# Altium project CANLink.PrjPcb (part 1 of 2)
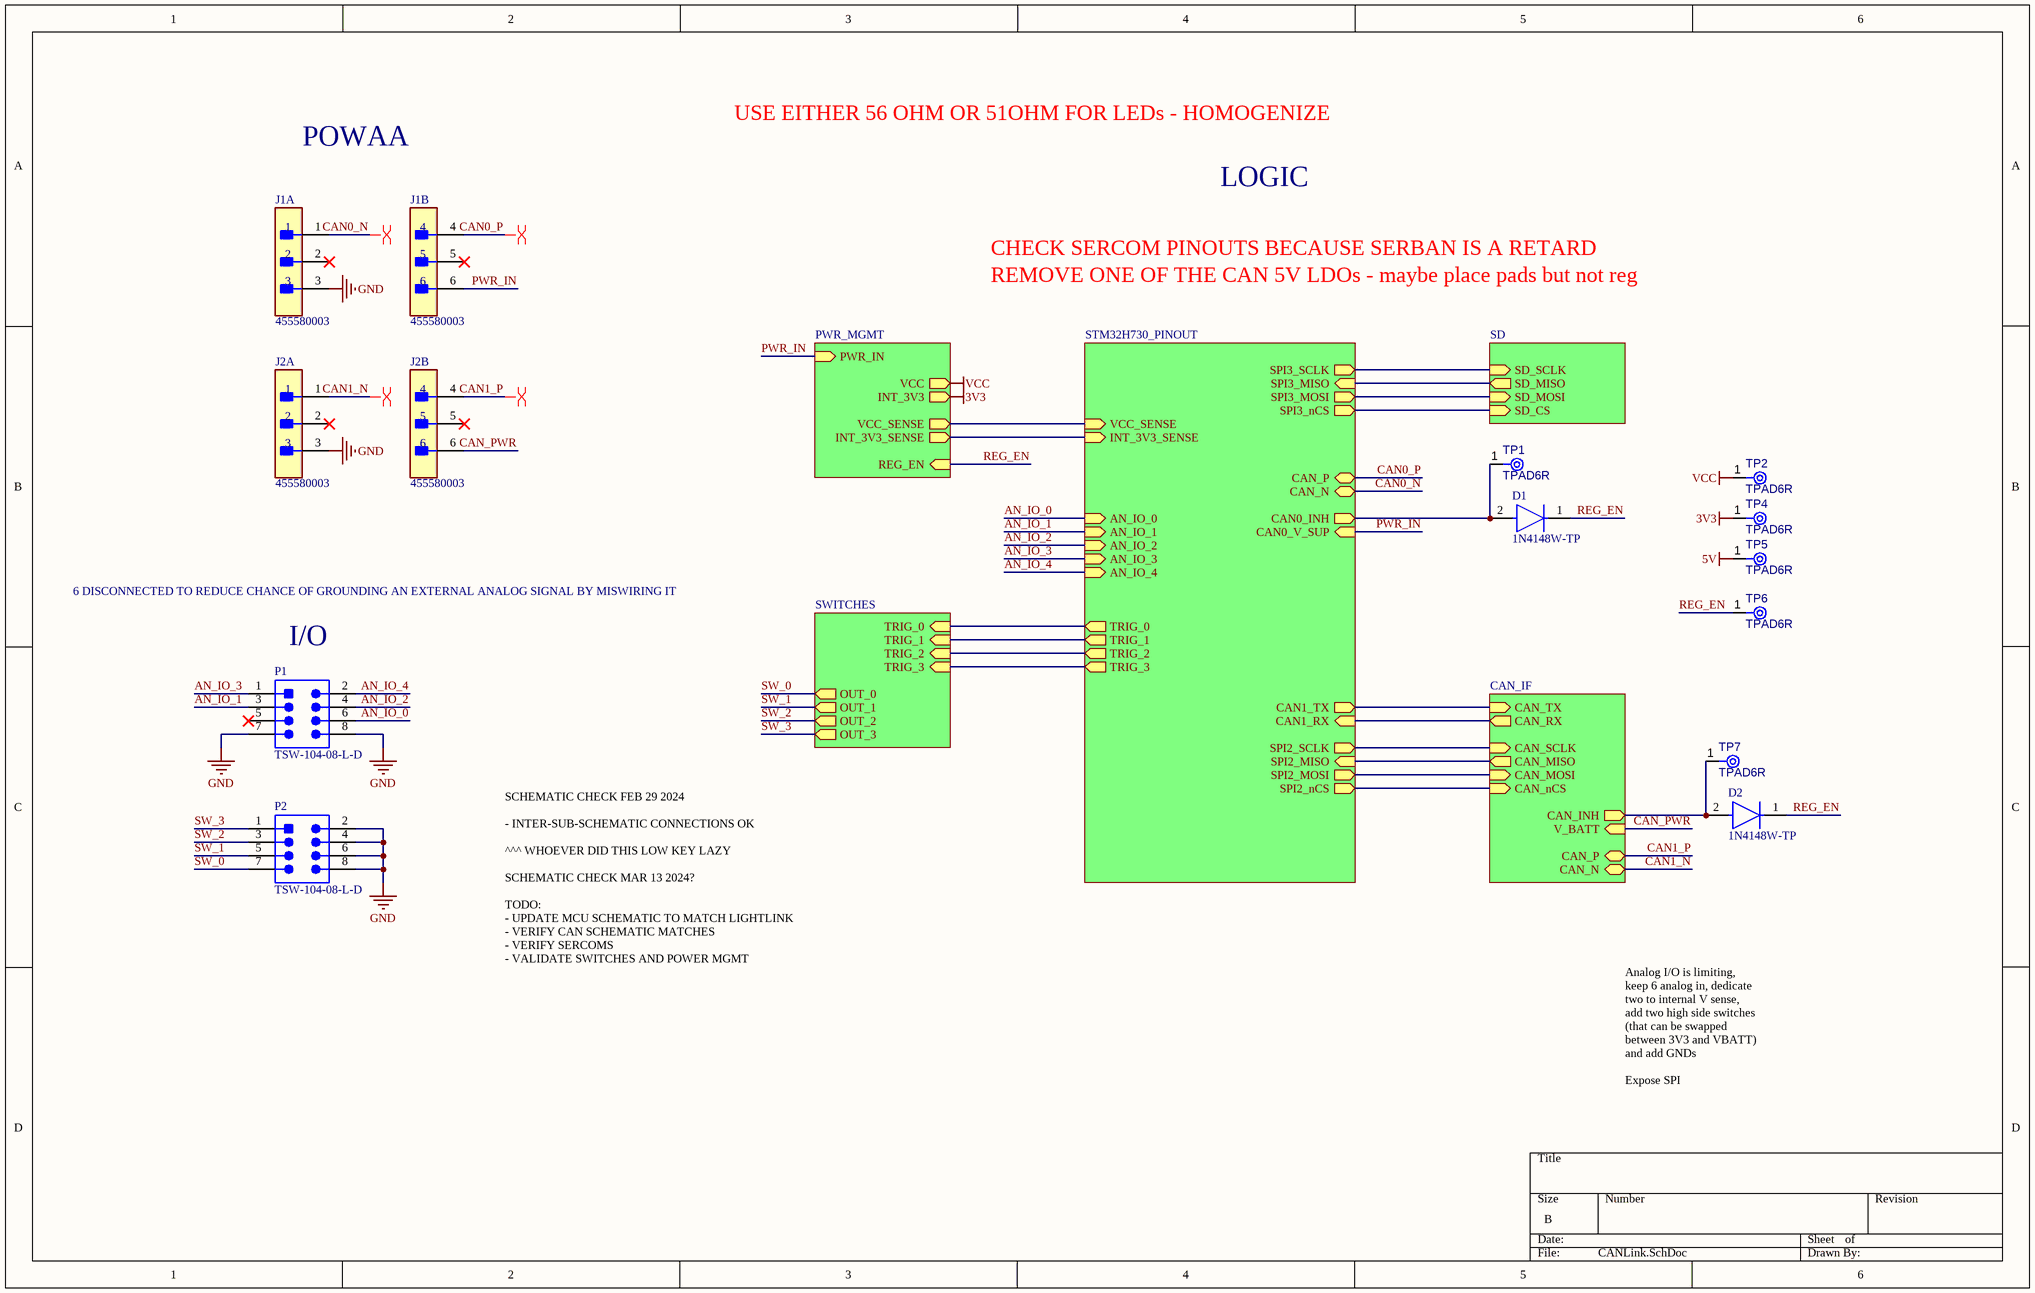
[diagram p0: CANLink.SchDoc]
6 sheets, 171 parts. Net scope: hierarchical (ports join the sheet entries above them; power ports are global).
Board file: CANLink.PcbDoc
Sheets:
  CANLink.SchDoc
    MCU_0 = STM32H730_PINOUT.SchDoc
    SD_0 = SD.SchDoc
    CAN_1 = CAN_IF.SchDoc
    PWR_MGMT = PWR_MGMT.SchDoc
    SWITCHES = SWITCHES.SchDoc

## Sheet CANLink.SchDoc
size B; SheetNumber: 1; SheetTotal: 6

### Parts
(Parts that share a designator on the sheet are numbered #1, #2 ... from top to bottom, then left to right.)
D1#1  1N4148W-TP  [FP-SOD-123-IPC_A]
D2  1N4148W-TP  [FP-SOD-123-IPC_A]
J1  455580003  [FP-455580003-MFG]  (parts A,B of 2)
J2  455580003  [FP-455580003-MFG]  (parts A,B of 2)
P1  TSW-104-08-L-D  [SMTC-TSW-104-08-L-D_V]
P2  TSW-104-08-L-D  [SMTC-TSW-104-08-L-D_V]
TP1  TPAD6R  [TP06R]  (no BOM)
TP2  TPAD6R  [TP06R]  (no BOM)
TP4  TPAD6R  [TP06R]  (no BOM)
TP5  TPAD6R  [TP06R]  (no BOM)
TP6  TPAD6R  [TP06R]  (no BOM)
TP7  TPAD6R  [TP06R]  (no BOM)

### Sub-sheets
CAN_1 = CAN_IF: CAN_TX (in), CAN_RX (out), CAN_SCLK (in), CAN_MISO (out), CAN_MOSI (in), CAN_nCS (in), CAN_INH (out), V_BATT (in), CAN_P (bidir), CAN_N (bidir)
MCU_0 = STM32H730_PINOUT: SPI2_MOSI (out), SPI2_MISO (in), SPI2_SCLK (out), SPI2_nCS (out), CAN1_TX (out), CAN1_RX (in), SPI3_MOSI (out), SPI3_MISO (in), SPI3_nCS (out), VCC_SENSE (in), INT_3V3_SENSE (in), AN_IO_1 (in), AN_IO_0 (in), AN_IO_2 (in), AN_IO_3 (in), AN_IO_4 (in), TRIG_0 (out), TRIG_1 (out), TRIG_2 (out), TRIG_3 (out), CAN0_INH (out), CAN_P (bidir), CAN_N (bidir), CAN0_V_SUP (in), SPI3_SCLK (out)
PWR_MGMT = PWR_MGMT: PWR_IN (in), VCC (out), INT_3V3 (out), VCC_SENSE (out), INT_3V3_SENSE (out), REG_EN (in)
SD_0 = SD: SD_MOSI (in), SD_CS (in), SD_MISO (out), SD_SCLK (in)
SWITCHES = SWITCHES: TRIG_0 (in), TRIG_1 (in), TRIG_2 (in), TRIG_3 (in), OUT_0 (out), OUT_1 (out), OUT_2 (out), OUT_3 (out)

### Nets
3V3: TP4.1(TP) ; sheet PWR_MGMT/INT_3V3  [project net INT_3V3]
5V: TP5.1(TP)
GND: J1.3 J2.3 P1.7 P1.8 P2.2 P2.4 P2.6 P2.8
VCC: TP2.1(TP) ; sheet PWR_MGMT/VCC  [project net PRE_VCC]
AN_IO_0: P1.6 ; sheet MCU_0/AN_IO_0
AN_IO_1: P1.3 ; sheet MCU_0/AN_IO_1
AN_IO_2: P1.4 ; sheet MCU_0/AN_IO_2
AN_IO_3: P1.1 ; sheet MCU_0/AN_IO_3
AN_IO_4: P1.2 ; sheet MCU_0/AN_IO_4
CAN0_INH: D1#1.2(A) TP1.1(TP) ; sheet MCU_0/CAN0_INH
CAN0_N: J1.1 ; sheet MCU_0/CAN_N
CAN0_P: J1.4 ; sheet MCU_0/CAN_P
CAN1_N: J2.1 ; sheet CAN_1/CAN_N
CAN1_P: J2.4 ; sheet CAN_1/CAN_P
CAN1_RX: sheet MCU_0/CAN1_RX, sheet CAN_1/CAN_RX
CAN1_TX: sheet MCU_0/CAN1_TX, sheet CAN_1/CAN_TX
CAN_INH: D2.2(A) TP7.1(TP) ; sheet CAN_1/CAN_INH
CAN_MISO: sheet MCU_0/SPI2_MISO, sheet CAN_1/CAN_MISO
CAN_MOSI: sheet MCU_0/SPI2_MOSI, sheet CAN_1/CAN_MOSI
CAN_nCS: sheet MCU_0/SPI2_nCS, sheet CAN_1/CAN_nCS
CAN_PWR: J2.6 ; sheet CAN_1/V_BATT
CAN_SCLK: sheet MCU_0/SPI2_SCLK, sheet CAN_1/CAN_SCLK
INT_3V3_SENSE: sheet MCU_0/INT_3V3_SENSE, sheet PWR_MGMT/INT_3V3_SENSE
PWR_IN: J1.6 ; sheet MCU_0/CAN0_V_SUP, sheet PWR_MGMT/PWR_IN  [project net CAN0_V_SUP]
REG_EN: D1#1.1(C) D2.1(C) TP6.1(TP) ; sheet PWR_MGMT/REG_EN
SD_CLK: sheet MCU_0/SPI3_SCLK, sheet SD_0/SD_SCLK
SD_CMD: sheet MCU_0/SPI3_MOSI, sheet SD_0/SD_MOSI
SD_CS: sheet MCU_0/SPI3_nCS, sheet SD_0/SD_CS
SD_DAT0: sheet MCU_0/SPI3_MISO, sheet SD_0/SD_MISO
SW_0: P2.7 ; sheet SWITCHES/OUT_0  [project net OUT_0]
SW_1: P2.5 ; sheet SWITCHES/OUT_1  [project net OUT_1]
SW_2: P2.3 ; sheet SWITCHES/OUT_2  [project net OUT_2]
SW_3: P2.1 ; sheet SWITCHES/OUT_3  [project net OUT_3]
TRIG_0: sheet MCU_0/TRIG_0, sheet SWITCHES/TRIG_0
TRIG_1: sheet MCU_0/TRIG_1, sheet SWITCHES/TRIG_1
TRIG_2: sheet MCU_0/TRIG_2, sheet SWITCHES/TRIG_2
TRIG_3: sheet MCU_0/TRIG_3, sheet SWITCHES/TRIG_3
VCC_SENSE: sheet MCU_0/VCC_SENSE, sheet PWR_MGMT/VCC_SENSE

Not connected (* = marked no-connect by the designer): J1 2* 5*; J2 2* 5*; P1 5*

### Layout directives
differential pair: CAN0_N, CAN0_P, CAN1_N, CAN1_P

### Notes on the sheet
- POWAA
- USE EITHER 56 OHM OR 51OHM FOR LEDs - HOMOGENIZE
- LOGIC
- CHECK SERCOM PINOUTS BECAUSE SERBAN IS A RETARD
- REMOVE ONE OF THE CAN 5V LDOs - maybe place pads but not reg
- 6 DISCONNECTED TO REDUCE CHANCE OF GROUNDING AN EXTERNAL ANALOG SIGNAL BY MISWIRING IT
- (near P1) I/O
- Analog I/O is limiting, keep 6 analog in, dedicate two to internal V sense, add two high side switches (that can be swapped between 3V3 and VBATT) and add GNDs
  Expose SPI
- SCHEMATIC CHECK FEB 29 2024
  - INTER-SUB-SCHEMATIC CONNECTIONS OK
  ^^^ WHOEVER DID THIS LOW KEY LAZY
  SCHEMATIC CHECK MAR 13 2024?
  TODO:
  - UPDATE MCU SCHEMATIC TO MATCH LIGHTLINK
  - VERIFY CAN SCHEMATIC MATCHES
  - VERIFY SERCOMS
  - VALIDATE SWITCHES AND POWER MGMT

### Library data of the parts
D1#1 D2 = CMP-2000-04993-2: DIODE GEN PURP 100V 150MA SOD123; Max Reverse Leakage Current: 5uA; Max Surge Current: 2A; Reverse Recovery Time: 4ns; Polarity: Standard; Capacitance: 4pF; Max Forward Surge Current (Ifsm): 1A; Element Configuration: Single; Power Dissipation: 400mW; Forward Voltage: 1V; Radiation Hardening: No; Lead Free: Lead Free; Max Reverse Voltage (DC): 100V; Current Rating: 150mA; Forward Current: 150mA; Packaging: Tape and Reel; Number of Pins: 2; Package Quantity: 3000; Max Operating Temperature: 150°C; Min Operating Temperature: -65°C; Average Rectified Current: 150mA; Recovery Time: 4ns; Output Current: 150mA; Peak Non-Repetitive Surge Current: 2A; Width: 1.8mm; Voltage Rating (DC): 100V; Height: 1.2mm; Max Repetitive Reverse Voltage (Vrrm): 100V; Mount: Surface Mount; Length: 2.85mm
J1 J2 = CMP-04776-000024-1: CONN HEADER R/A 6POS 4.2MM; Manufacturer: Molex; Standoff Height: 0.4mm; Conn Orientation: Right Angle; Number Of Contacts: 6; Conn Gender: Male; Voltage Rating: 600V; Current Rating: 8A; Footprint Url: https://www.molex.com/pdm_docs/sd/455580003_sd.pdf; Number Of Rows: 2; Lead Free: Yes; Digikey Description: CONN HEADER R/A 6POS 4.2MM; ComponentLink2URL: https://www.molex.com/webdocs/datasheets/pdf/en-us/0455580003_PCB_HEADERS.pdf; Octopart: https://octopart.com/45558-0003-molex-7672845; Package: 0; Device Class L3: unset; ComponentLink2Description: Datasheet; Device Class L2: Headers and Wire Housings; Category: Conn; Contact Material: Tin,Nickel; Mouser Description: Conn Power HDR 6 POS 4.2mm Solder ST Thru-Hole 6 Terminal 1 Port Mini-Fit Jr™ Tray; Manufacturer Part Number: 455580003; Pitch: 4.2mm; Device Class L1: Connectors; Temperature Range Low: -40°C; Temperature: -40°C to +105°C; RoHS: TRUE; Temperature Range High: +105°C; Height: 10.38mm; Automotive: No
P1 P2 = CMP-1681-00006-4: Male Header, Pitch 2.54 mm, 2 x 4 Position, Height 8.38 mm, Tail Length 5.08 mm, -55 to 125 degC, RoHS, Bulk; Manufacturer: Samtec; Voltage Rating: 550 V; Current Rating: 7.6 A; Rows: 2; ComponentLink2URL: https://datasheet.ciiva.com/25616/0900766b81154476-25616879.pdf; Package Quantity: 1; PackageDescription: Male Header, Pitch 2.54 mm, 2 x 4 Position, Height 8.38 mm, Tail Length 5.08 mm; ComponentLink1Description: Manufacturer URL; Lead Pitch: 0.1 inch; REACH SVHC: No SVHC; Mounting Technology: Through Hole; PackageReference: TSW-104-08-L-D; Contact Plating: Gold; DatasheetVersion: 04/2012; Colour: Black; Contact Finish: Gold; ComponentLink3URL: http://suddendocs.samtec.com/prints/tsw-xxx-xx-x-x-xx-xxx-footprint.pdf; ComponentLink3Description: Package Specification; Mount: Through Hole; RoHSCompliant: true; Packaging: Bulk; ComponentLink2Description: Datasheet; Contact Material: Bronze; Pins: 8; ComponentLink1URL: http://www.samtec.com/
TP1 TP2 TP4-TP7 = CMP-00028-00002-2: 0.6mm round; Pins: 1

## Sheet STM32H730_PINOUT.SchDoc
size D; SheetNumber: 5; SheetTotal: 6
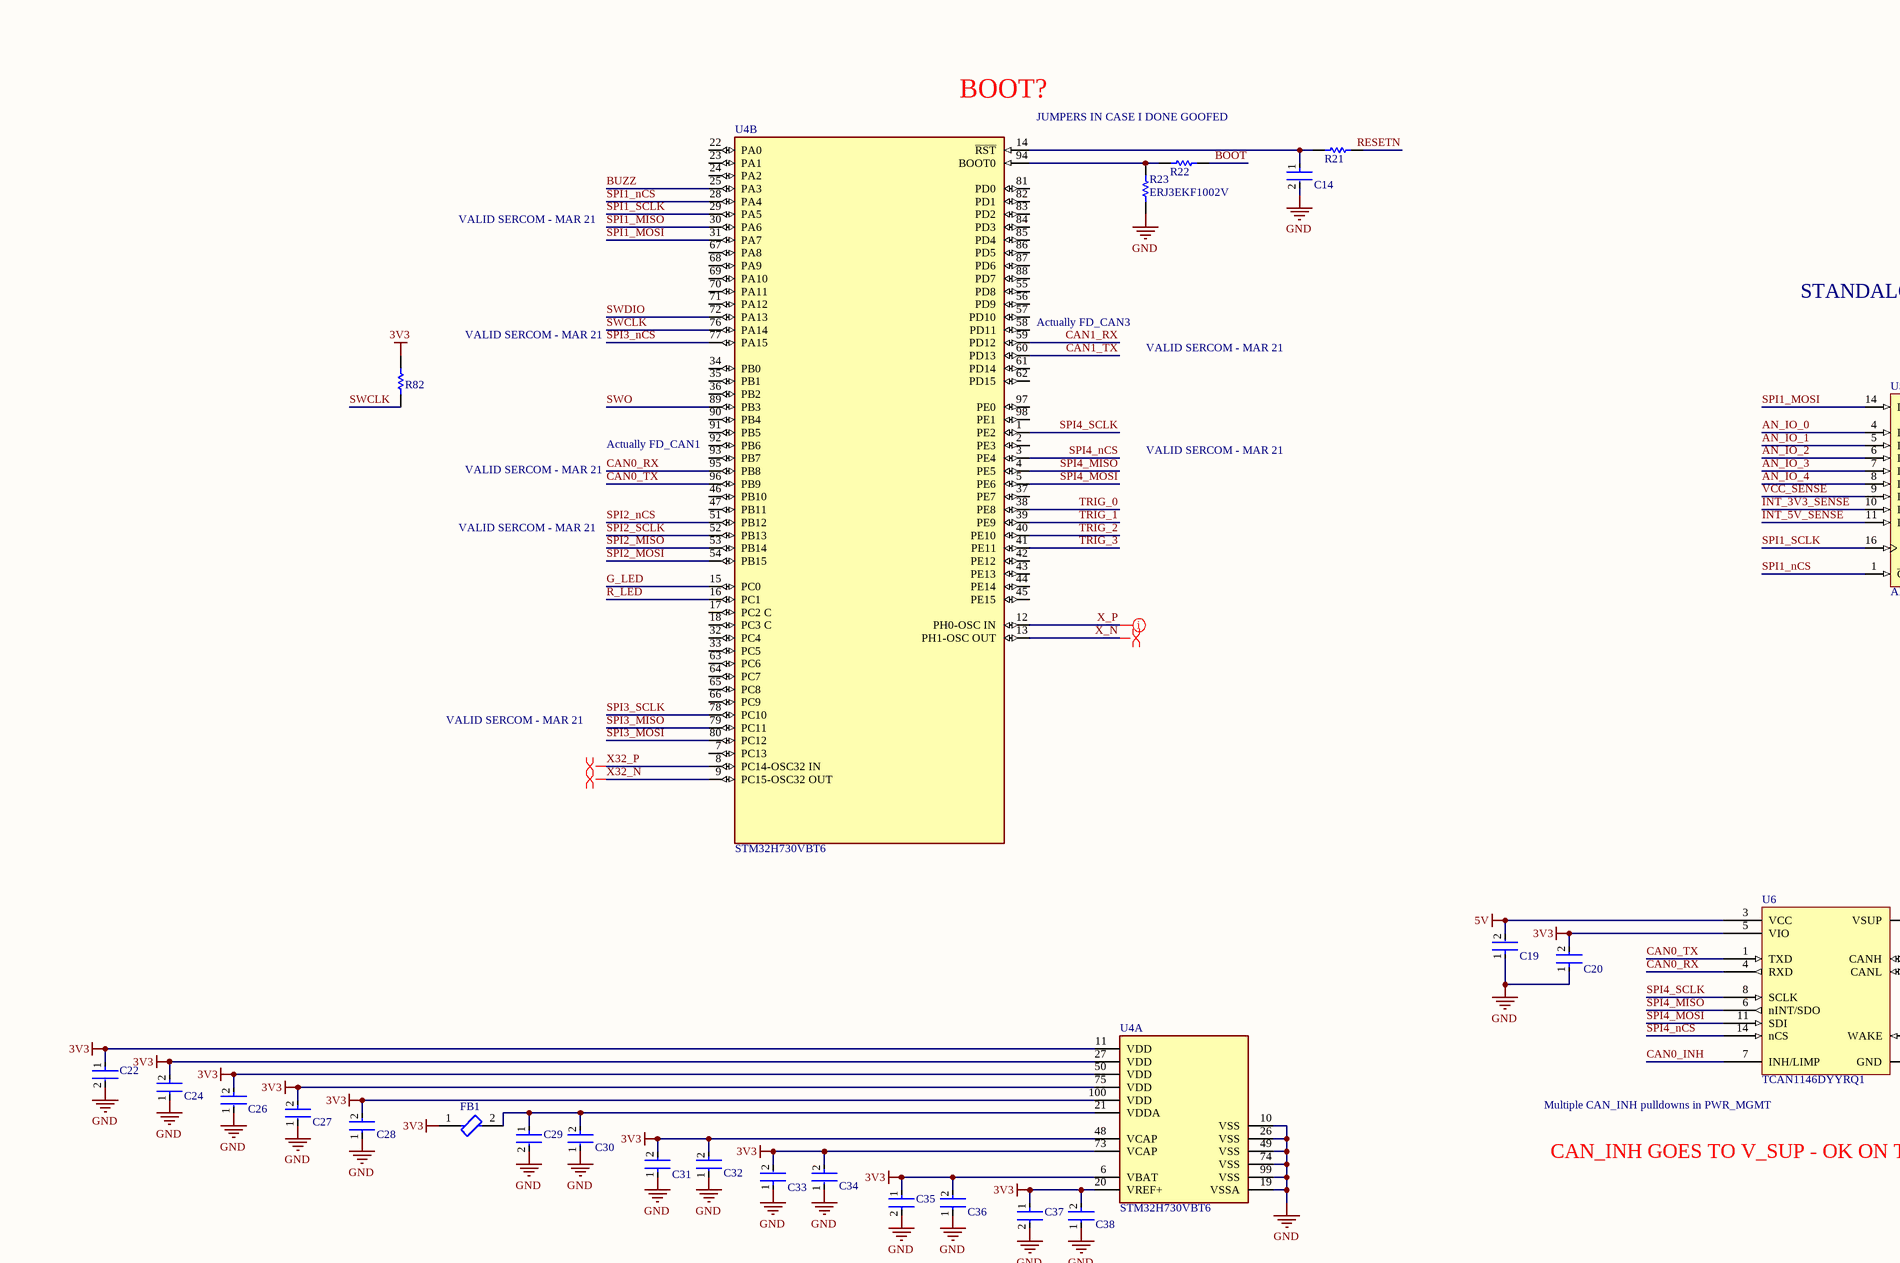
[diagram p1: STM32H730_PINOUT.SchDoc, top left]
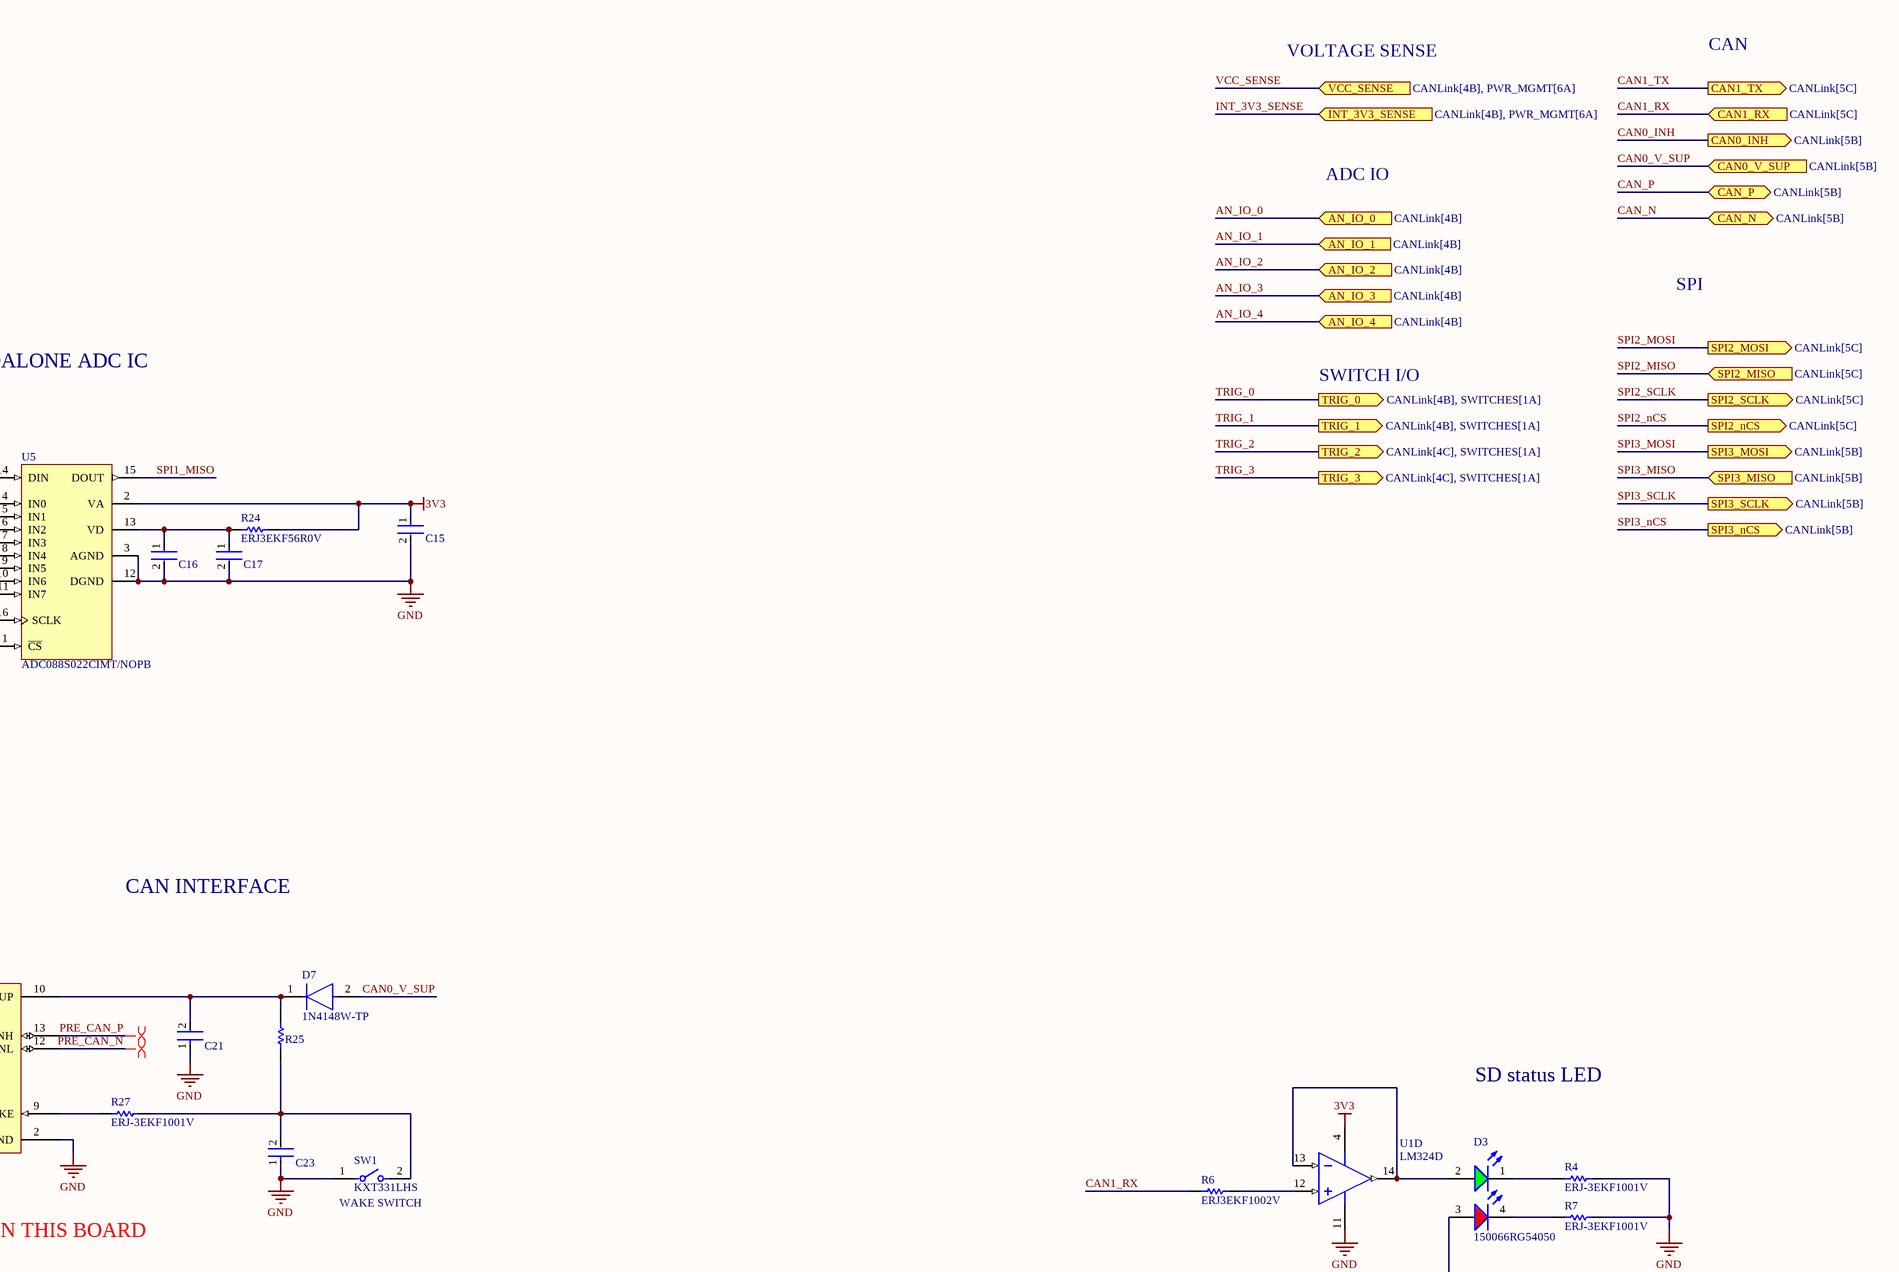
[diagram p2: STM32H730_PINOUT.SchDoc, top right]
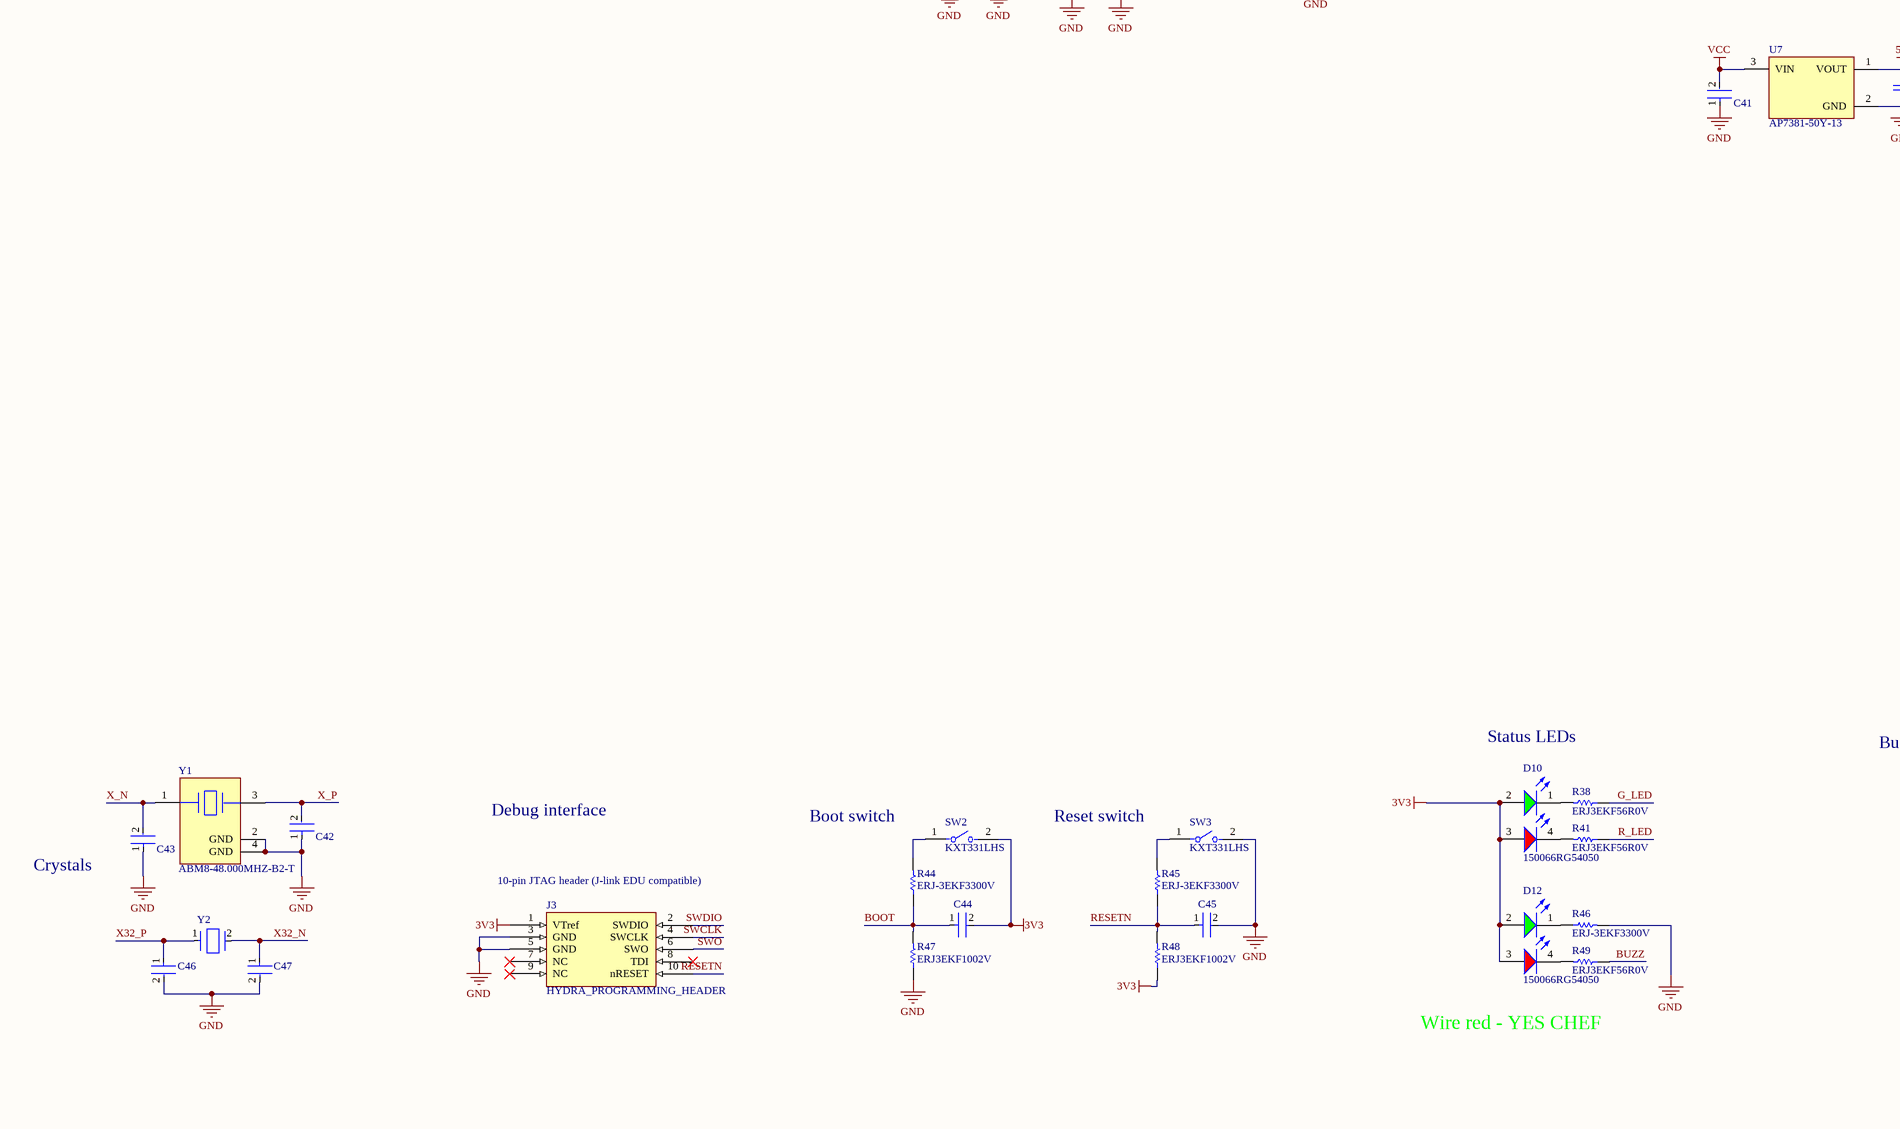
[diagram p3: STM32H730_PINOUT.SchDoc, bottom left]
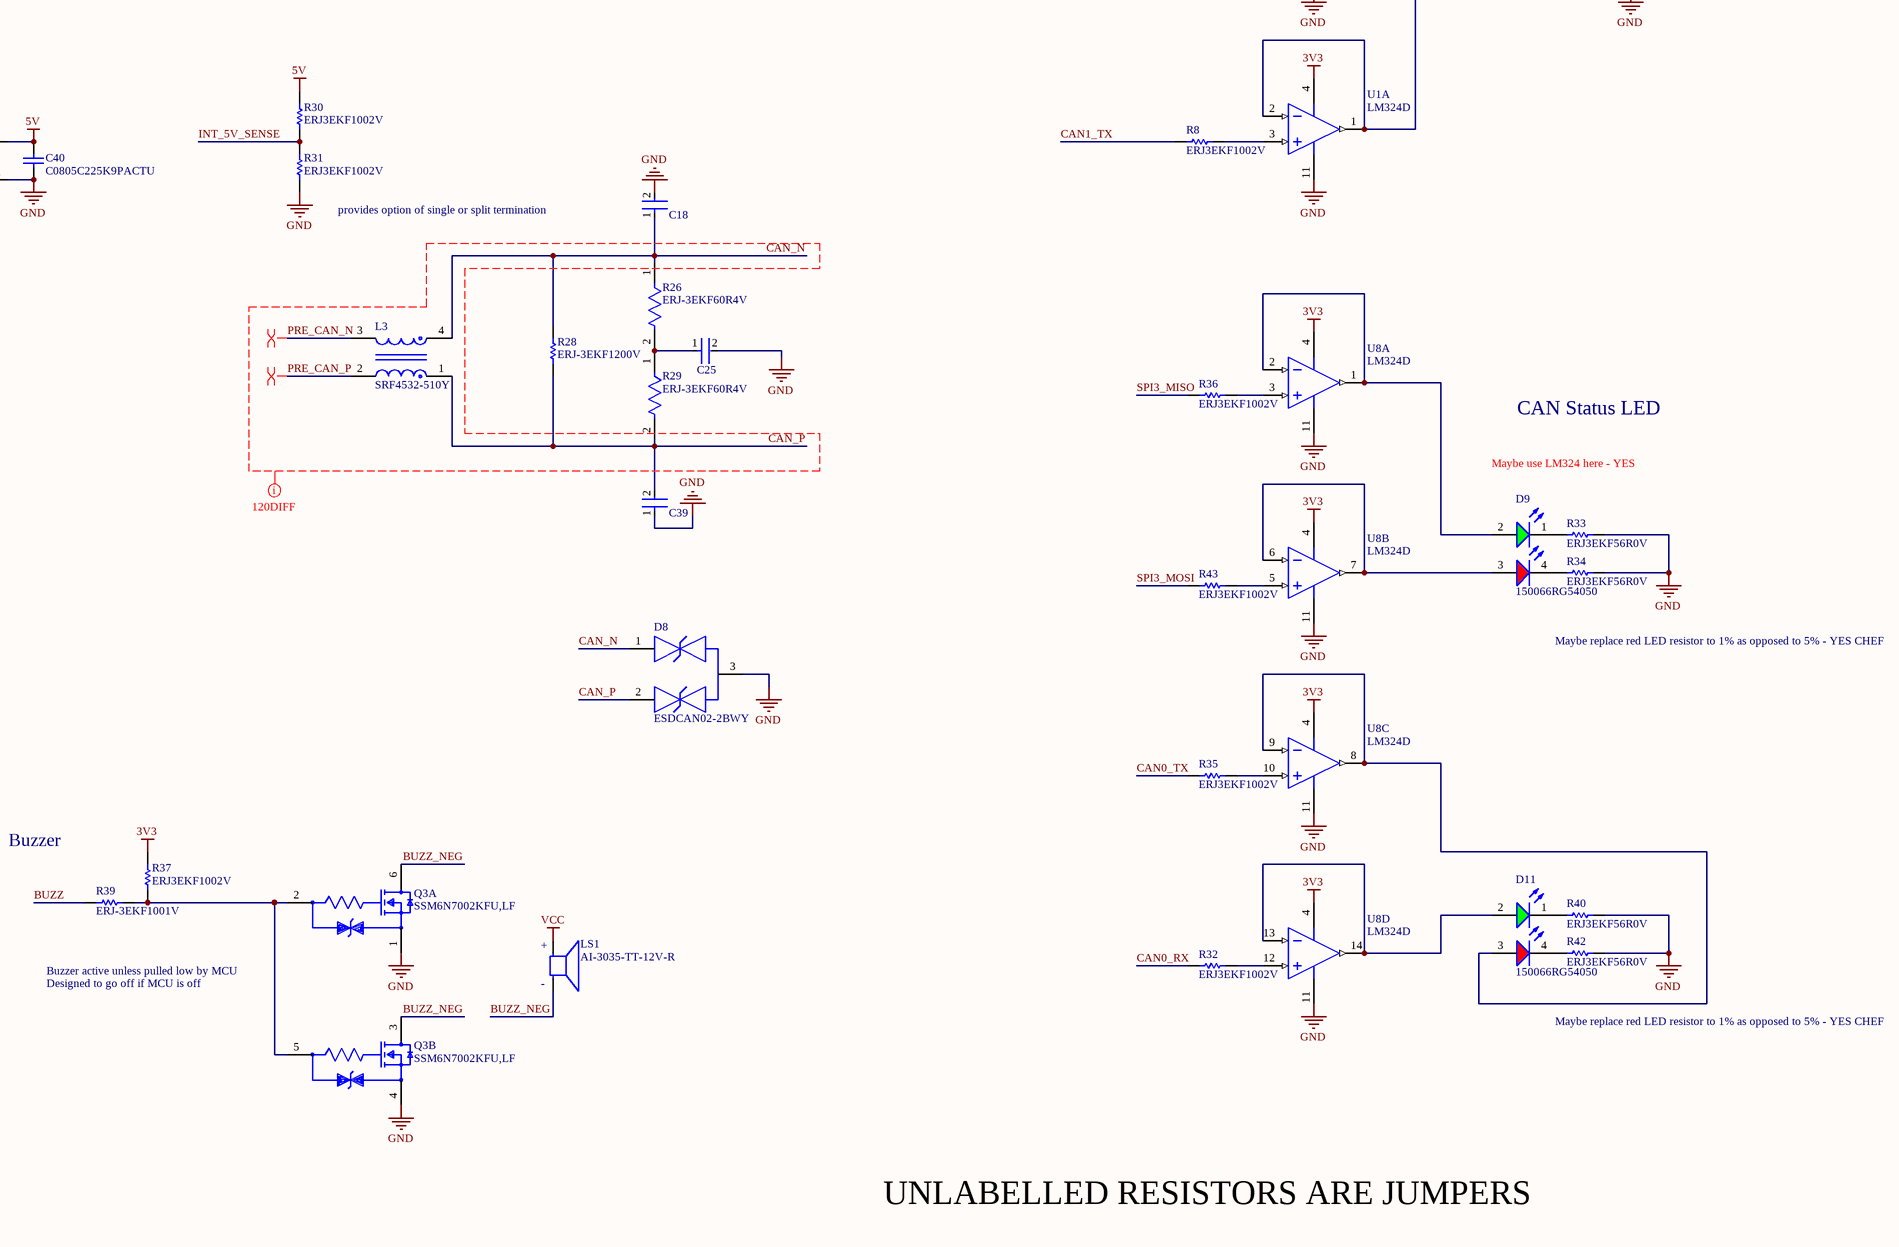
[diagram p4: STM32H730_PINOUT.SchDoc, bottom right]

### Parts
(Parts that share a designator on the sheet are numbered #1, #2 ... from top to bottom, then left to right.)
C14  C0402C104K8PACTU  [FP-C0402-BB-MFG]  (value not drawn)
C15  C0402C104K8PACTU  [FP-C0402-BB-MFG]  (value not drawn)
C16  C0402C104K8PACTU  [FP-C0402-BB-MFG]  (value not drawn)
C17  C0402C104K8PACTU  [FP-C0402-BB-MFG]  (value not drawn)
C18  C0402C104K8PACTU  [FP-C0402-BB-MFG]  (value not drawn)
C19  C0402C104K8PACTU  [FP-C0402-BB-MFG]  (value not drawn)
C20  C0402C104K8PACTU  [FP-C0402-BB-MFG]  (value not drawn)
C21  C0402C104K8PACTU  [FP-C0402-BB-MFG]  (value not drawn)
C22  C1005X5R1A475K050BC  [FP-C1005-050-0_15-MFG]  (value not drawn)
C23  C0402C104K8PACTU  [FP-C0402-BB-MFG]  (value not drawn)
C24  GRM155R71C104KA88D  [FP-GRM15-MFG]  (value not drawn)
C25  C0402C104K8PACTU  [FP-C0402-BB-MFG]  (value not drawn)
C26  GRM155R71C104KA88D  [FP-GRM15-MFG]  (value not drawn)
C27  GRM155R71C104KA88D  [FP-GRM15-MFG]  (value not drawn)
C28  GRM155R71C104KA88D  [FP-GRM15-MFG]  (value not drawn)
C29  EMK105BJ105KV-F  [FP-0402-L_1_0_0_05-W_0_5-IPC_A]  (value not drawn)
C30  GRM155R71C104KA88D  [FP-GRM15-MFG]  (value not drawn)
C31  C1005X7S1A225K050BC  [FP-C1005-050-0_15-0_1-MFG]  (value not drawn)
C32  GRM155R71C104KA88D  [FP-GRM15-MFG]  (value not drawn)
C33  C1005X7S1A225K050BC  [FP-C1005-050-0_15-0_1-MFG]  (value not drawn)
C34  GRM155R71C104KA88D  [FP-GRM15-MFG]  (value not drawn)
C35  EMK105BJ105KV-F  [FP-0402-L_1_0_0_05-W_0_5-IPC_A]  (value not drawn)
C36  GRM155R71C104KA88D  [FP-GRM15-MFG]  (value not drawn)
C37  EMK105BJ105KV-F  [FP-0402-L_1_0_0_05-W_0_5-IPC_A]  (value not drawn)
C38  GRM155R71C104KA88D  [FP-GRM15-MFG]  (value not drawn)
C39  C0402C104K8PACTU  [FP-C0402-BB-MFG]  (value not drawn)
C40  C0805C225K9PACTU  [CAPC2013X145X50ML20T25]
C41  C0402C104K8PACTU  [FP-C0402-BB-MFG]  (value not drawn)
C42  08051A6R8CAT2A  [FP-0805-L_2_01_0_2-W_1_25-MFG]  (value not drawn)
C43  08051A6R8CAT2A  [FP-0805-L_2_01_0_2-W_1_25-MFG]  (value not drawn)
C44  C0402C104K8PACTU  [FP-C0402-BB-MFG]  (value not drawn)
C45  C0402C104K8PACTU  [FP-C0402-BB-MFG]  (value not drawn)
C46  C0805C180J5GACTU  [FP-C0805C-DN-MFG]  (value not drawn)
C47  C0805C180J5GACTU  [FP-C0805C-DN-MFG]  (value not drawn)
D3  150066RG54050  [WL-SBCD_0606]
D7  1N4148W-TP  [FP-SOD-123-IPC_A]
D8  ESDCAN02-2BWY  [FP-SOT323-3L-MFG]
D9#1  150066RG54050  [WL-SBCD_0606]
D10  150066RG54050  [WL-SBCD_0606]
D11  150066RG54050  [WL-SBCD_0606]
D12  150066RG54050  [WL-SBCD_0606]
FB1  BLM15PX601SN1D  [FP-BLM15-0_05-MFG]  (value not drawn)
J3  HYDRA_PROGRAMMING_HEADER  [3220-10-0300-00-Footprint-1]
L3  SRF4532-510Y  [FP-SRF4532-MFG]
LS1  AI-3035-TT-12V-R  [AI-3035-TT-12V-R-Footprint-1]
Q3#1  SSM6N7002KFU,LF  [FP-SSOP6-P-0_65A-MFG]  (parts A,B of 2)
R4#1  ERJ-3EKF1001V  [RESC1608X55X30LL15T15]
R6  ERJ3EKF1002V  [RESC1609X55X30LL15T15]
R7  ERJ-3EKF1001V  [RESC1608X55X30LL15T15]
R8  ERJ3EKF1002V  [RESC1609X55X30LL15T15]
R21  0402 JUMPER 0 OHM  [RESC1005X40X25NL05T05]  (value not drawn)
R22  0402 JUMPER 0 OHM  [RESC1005X40X25NL05T05]  (value not drawn)
R23  ERJ3EKF1002V  [RESC1609X55X30LL15T15]
R24  ERJ3EKF56R0V  [RESC1608X55X30NL15T15]
R25  ERJ3EKF1002V  [RESC1609X55X30LL15T15]  (value not drawn)
R26  ERJ-3EKF60R4V  [FP-ERJ3EK-IPC_C]
R27  ERJ-3EKF1001V  [RESC1608X55X30LL15T15]
R28  ERJ-3EKF1200V  [RESC1609X55X30ML15T15]
R29  ERJ-3EKF60R4V  [FP-ERJ3EK-IPC_C]
R30  ERJ3EKF1002V  [RESC1609X55X30LL15T15]
R31  ERJ3EKF1002V  [RESC1609X55X30LL15T15]
R32  ERJ3EKF1002V  [RESC1609X55X30LL15T15]
R33  ERJ3EKF56R0V  [RESC1608X55X30NL15T15]
R34  ERJ3EKF56R0V  [RESC1608X55X30NL15T15]
R35  ERJ3EKF1002V  [RESC1609X55X30LL15T15]
R36  ERJ3EKF1002V  [RESC1609X55X30LL15T15]
R37#1  ERJ3EKF1002V  [RESC1609X55X30LL15T15]
R38#1  ERJ3EKF56R0V  [RESC1608X55X30NL15T15]
R39#1  ERJ-3EKF1001V  [RESC1608X55X30LL15T15]
R40#1  ERJ3EKF56R0V  [RESC1608X55X30NL15T15]
R41#1  ERJ3EKF56R0V  [RESC1608X55X30NL15T15]
R42#1  ERJ3EKF56R0V  [RESC1608X55X30NL15T15]
R43#1  ERJ3EKF1002V  [RESC1609X55X30LL15T15]
R44#1  ERJ-3EKF3300V  [RESC1608X55X30LL15T15]
R45#1  ERJ-3EKF3300V  [RESC1608X55X30LL15T15]
R46#1  ERJ-3EKF3300V  [RESC1608X55X30LL15T15]
R47#1  ERJ3EKF1002V  [RESC1609X55X30LL15T15]
R48#1  ERJ3EKF1002V  [RESC1609X55X30LL15T15]
R49#1  ERJ3EKF56R0V  [RESC1608X55X30NL15T15]
R82  ERJ3EKF1002V  [RESC1609X55X30LL15T15]  (value not drawn)
SW1  KXT331LHS  [FP-KXT331LHS-MFG]
SW2  KXT331LHS  [FP-KXT331LHS-MFG]
SW3  KXT331LHS  [FP-KXT331LHS-MFG]
U1  LM324D  [D0014A_L]  (parts A,D of 4)
U4  STM32H730VBT6  [FP-LQFP100-1L-IPC_C]  (parts A,B of 2)
U5  ADC088S022CIMT/NOPB  [MTC16_L]
U6  TCAN1146DYYRQ1  [TCAN1146DYYRQ1-Footprint-1]
U7  AP7381-50Y-13  [FP-SOT89-MFG]
U8  LM324D  [D0014A_L]  (parts A,B,C,D of 4)
Y1  ABM8-48.000MHZ-B2-T  [FP-ABM8-MFG]
Y2  ECS-.327-12.5-1210-TR  [FP-ECX-1210-MFG]  (value not drawn)

### Ports
AN_IO_0 (in, see CANLink[4B]), AN_IO_1 (in, see CANLink[4B]), AN_IO_2 (in, see CANLink[4B]), AN_IO_3 (in, see CANLink[4B]), AN_IO_4 (in, see CANLink[4B]), CAN0_INH (out, see CANLink[5B]), CAN0_V_SUP (in, see CANLink[5B]), CAN1_RX (in, see CANLink[5C]), CAN1_TX (out, see CANLink[5C]), CAN_N (bidir, see CANLink[5B]), CAN_P (bidir, see CANLink[5B]), INT_3V3_SENSE (in, see CANLink[4B], PWR_MGMT[6A]), SPI2_MISO (in, see CANLink[5C]), SPI2_MOSI (out, see CANLink[5C]), SPI2_nCS (out, see CANLink[5C]), SPI2_SCLK (out, see CANLink[5C]), SPI3_MISO (in, see CANLink[5B]), SPI3_MOSI (out, see CANLink[5B]), SPI3_nCS (out, see CANLink[5B]), SPI3_SCLK (out, see CANLink[5B]), TRIG_0 (out, see CANLink[4B], SWITCHES[1A]), TRIG_1 (out, see CANLink[4B], SWITCHES[1A]), TRIG_2 (out, see CANLink[4C], SWITCHES[1A]), TRIG_3 (out, see CANLink[4C], SWITCHES[1A]), VCC_SENSE (in, see CANLink[4B], PWR_MGMT[6A])

### Nets
3V3: C15.1 C20.2 C22.1 C24.2 C26.2 C27.2 C28.2 C31.2 C32.2 C33.2 C34.2 C35.1 C36.2 C37.1 C38.2 C44.2 D10.2(A) D10.3(A) D12.2(A) D12.3(A) FB1.1 J3.1(VTref) R24.1 R37#1.2 R48#1.1 R82.1 SW2.2 U1.4(VCC) U4.6(VBAT) U4.11(VDD) U4.20(VREF+) U4.27(VDD) U4.48(VCAP) U4.50(VDD) U4.73(VCAP) U4.75(VDD) U4.100(VDD) U5.2(VA) U6.5(VIO) U8.4(VCC)  [project net INT_3V3]
5V: C19.2 C40.2 R30.2 U6.3(VCC) U7.1(VOUT)
GND: C14.2 C15.2 C16.2 C17.2 C18.2 C19.1 C20.1 C21.1 C22.2 C23.1 C24.1 C25.2 C26.1 C27.1 C28.1 C29.2 C30.1 C31.1 C32.1 C33.1 C34.1 C35.2 C36.1 C37.2 C38.1 C39.1 C40.1 C41.1 C42.1 C43.1 C45.2 C46.2 C47.2 D8.3 J3.3(GND) J3.5(GND) Q3#1.1(Source1) Q3#1.4(Source2) R4#1.2 R7.2 R23.1 R31.2 R33.1 R34.1 R40#1.1 R42#1.1 R46#1.2 R47#1.1 SW1.1 SW3.2 U1.11(GND) U4.10(VSS) U4.19(VSSA) U4.26(VSS) U4.49(VSS) U4.74(VSS) U4.99(VSS) U5.3(AGND) U5.12(DGND) U6.2(GND) U7.2(GND) U8.11(GND) Y1.2(GND) Y1.4(GND)
VCC: C41.2 LS1.P U7.3(VIN)  [project net PRE_VCC]
AN_IO_0: U5.4(IN0) ; port AN_IO_0
AN_IO_1: U5.5(IN1) ; port AN_IO_1
AN_IO_2: U5.6(IN2) ; port AN_IO_2
AN_IO_3: U5.7(IN3) ; port AN_IO_3
AN_IO_4: U5.8(IN4) ; port AN_IO_4
BOOT: C44.1 R22.2 R44#1.1 R47#1.2
BUZZ: R39#1.1 R49#1.1 U4.25(PA3)
BUZZ_NEG: LS1.N Q3#1.3(Drain2) Q3#1.6(Drain1)
CAN0_INH: U6.7(INH/LIMP) ; port CAN0_INH
CAN0_RX: R32.1 U4.95(PB8) U6.4(RXD)
CAN0_TX: R35.1 U4.96(PB9) U6.1(TXD)
CAN0_V_SUP: D7.2(A) ; port CAN0_V_SUP
CAN1_RX: R6.1 U4.59(PD12) ; port CAN1_RX
CAN1_TX: R8.2 U4.60(PD13) ; port CAN1_TX
CAN_N: C18.1 D8.1 L3.4 R26.1 R28.1 ; port CAN_N  [project net CAN0_N]
CAN_P: C39.2 D8.2 L3.1 R28.2 R29.2 ; port CAN_P  [project net CAN0_P]
G_LED: R38#1.1 U4.15(PC0)
INT_3V3_SENSE: U5.10(IN6) ; port INT_3V3_SENSE
INT_5V_SENSE: R30.1 R31.1 U5.11(IN7)
PRE_CAN_N: L3.3 U6.12(CANL)
PRE_CAN_P: L3.2 U6.13(CANH)
R_LED: R41#1.1 U4.16(PC1)
RESETN: C45.1 J3.10(nRESET) R21.2 R45#1.1 R48#1.2
SPI1_MISO: U4.30(PA6) U5.15(DOUT)
SPI1_MOSI: U4.31(PA7) U5.14(DIN)
SPI1_nCS: U4.28(PA4) U5.1(~{CS})
SPI1_SCLK: U4.29(PA5) U5.16(SCLK)
SPI2_MISO: U4.53(PB14) ; port SPI2_MISO  [project net CAN_MISO]
SPI2_MOSI: U4.54(PB15) ; port SPI2_MOSI  [project net CAN_MOSI]
SPI2_nCS: U4.51(PB12) ; port SPI2_nCS  [project net CAN_nCS]
SPI2_SCLK: U4.52(PB13) ; port SPI2_SCLK  [project net CAN_SCLK]
SPI3_MISO: R36.1 U4.79(PC11) ; port SPI3_MISO  [project net SD_DAT0]
SPI3_MOSI: R43#1.1 U4.80(PC12) ; port SPI3_MOSI  [project net SD_CMD]
SPI3_nCS: U4.77(PA15) ; port SPI3_nCS  [project net SD_CS]
SPI3_SCLK: U4.78(PC10) ; port SPI3_SCLK  [project net SD_CLK]
SPI4_MISO: U4.4(PE5) U6.6(nINT/SDO)
SPI4_MOSI: U4.5(PE6) U6.11(SDI)
SPI4_nCS: U4.3(PE4) U6.14(nCS)
SPI4_SCLK: U4.1(PE2) U6.8(SCLK)
SWCLK: J3.4(SWCLK) R82.2 U4.76(PA14)
SWDIO: J3.2(SWDIO) U4.72(PA13)
SWO: J3.6(SWO) U4.89(PB3)
TRIG_0: U4.38(PE8) ; port TRIG_0
TRIG_1: U4.39(PE9) ; port TRIG_1
TRIG_2: U4.40(PE10) ; port TRIG_2
TRIG_3: U4.41(PE11) ; port TRIG_3
VCC_SENSE: U5.9(IN5) ; port VCC_SENSE
X32_N: C47.1 U4.9(PC15-OSC32_OUT) Y2.2(Out/In)
X32_P: C46.1 U4.8(PC14-OSC32_IN) Y2.1(In/Out)
X_N: C43.2 U4.13(PH1-OSC_OUT) Y1.1
X_P: C42.2 U4.12(PH0-OSC_IN) Y1.3
NetC14_1: C14.1 R21.1 U4.14(~{RST})
NetC16_1: C16.1 C17.1 R24.2 U5.13(VD)
NetC21_2: C21.2 D7.1(C) R25.1 U6.10(VSUP)
NetC23_2: C23.2 R25.2 R27.2 SW1.2
NetC25_1: C25.1 R26.2 R29.1
NetC29_1: C29.1 C30.2 FB1.2 U4.21(VDDA)
NetD3_1: D3.1(K) R4#1.1
NetD3_2: D3.2(A) U1.13(4IN-) U1.14(4OUT)
NetD3_3: D3.3(A) U1.1(1OUT) U1.2(1IN-)
NetD3_4: D3.4(K) R7.1
NetD9#1_1: D9#1.1(K) R33.2
NetD9#1_2: D9#1.2(A) U8.1(1OUT) U8.2(1IN-)
NetD9#1_3: D9#1.3(A) U8.6(2IN-) U8.7(2OUT)
NetD9#1_4: D9#1.4(K) R34.2
NetD10_1: D10.1(K) R38#1.2
NetD10_4: D10.4(K) R41#1.2
NetD11_1: D11.1(K) R40#1.2
NetD11_2: D11.2(A) U8.13(4IN-) U8.14(4OUT)
NetD11_3: D11.3(A) U8.8(3OUT) U8.9(3IN-)
NetD11_4: D11.4(K) R42#1.2
NetD12_1: D12.1(K) R46#1.1
NetD12_4: D12.4(K) R49#1.2
NetQ3#1_2: Q3#1.2(Gate1) Q3#1.5(Gate2) R37#1.1 R39#1.2
NetR6_2: R6.2 U1.12(4IN+)
NetR8_1: R8.1 U1.3(1IN+)
NetR22_1: R22.1 R23.2 U4.94(BOOT0)
NetR27_1: R27.1 U6.9(WAKE)
NetR32_2: R32.2 U8.12(4IN+)
NetR35_2: R35.2 U8.10(3IN+)
NetR36_2: R36.2 U8.3(1IN+)
NetR43#1_2: R43#1.2 U8.5(2IN+)
NetR44#1_2: R44#1.2 SW2.1
NetR45#1_2: R45#1.2 SW3.1

Not connected (* = marked no-connect by the designer): J3 7(NC)* 8(TDI)* 9(NC)*; U4 2(PE3) 7(PC13) 17(PC2_C) 18(PC3_C) 22(PA0) 23(PA1) 24(PA2) 32(PC4) 33(PC5) 34(PB0) 35(PB1) 36(PB2) 37(PE7) 42(PE12) 43(PE13) 44(PE14) 45(PE15) 46(PB10) 47(PB11) 55(PD8) 56(PD9) 57(PD10) 58(PD11) 61(PD14) 62(PD15) 63(PC6) 64(PC7) 65(PC8) 66(PC9) 67(PA8) 68(PA9) 69(PA10) 70(PA11) 71(PA12) 81(PD0) 82(PD1) 83(PD2) 84(PD3) 85(PD4) 86(PD5) 87(PD6) 88(PD7) 90(PB4) 91(PB5) 92(PB6) 93(PB7) 97(PE0) 98(PE1)

### Layout directives
differential pair: PRE_CAN_N, PRE_CAN_P, X32_N, X32_P, X_N, X_P
net class 120DIFF: CAN_N, CAN_P, PRE_CAN_N, PRE_CAN_P

### Notes on the sheet
- VOLTAGE SENSE
- CAN
- (near U4) BOOT?
- JUMPERS IN CASE I DONE GOOFED
- ADC IO
- VALID SERCOM - MAR 21
- SPI
- STANDALONE ADC IC
- (near U4) Actually FD_CAN3
- SWITCH I/O
- (near U4) Actually FD_CAN1
- CAN INTERFACE
- SD status LED
- (near U6) Multiple CAN_INH pulldowns in PWR_MGMT
- (near SW1) WAKE SWITCH
- CAN_INH GOES TO V_SUP - OK ON THIS BOARD
- provides option of single or split termination
- CAN Status LED
- Maybe use LM324 here - YES
- Maybe replace red LED resistor to 1% as opposed to 5% - YES CHEF
- Status LEDs
- Buzzer
- Debug interface
- Boot switch
- Reset switch
- (near C43) Crystals
- (near J3) 10-pin JTAG header (J-link EDU compatible)
- Buzzer active unless pulled low by MCU
- Designed to go off if MCU is off
- Wire red - YES CHEF
- UNLABELLED RESISTORS ARE JUMPERS
- (in symbol CMP-00027-00003-1) +; -

### Library data of the parts
C14-C21 C23 C25 C39 C41 C44 C45 = CMP-2008-02046-2: CAP CER 0.1UF 10V X5R 0402; Manufacturer: Kemet; Material: Ceramic; Capacitance: 0.10 μF; Temperature Coefficient: 15%; Tolerance: 0.1; Value: 0.10 μF; Package: C0402-BB; Temperature: -55°C to +125°C; ComponentLink2Description: Datasheet; Temperature Characteristic: X5R; Device Class L1: Passive Components; Height: 0.55mm; Lead Free: Yes; ComponentLink2URL: https://content.kemet.com/datasheets/KEM_C1002_X7R_SMD.pdf; Device Class L2: Capacitors; Temperature Range Low: -55°C; Temperature Range High: +125°C; RoHS: TRUE; Octopart: https://octopart.com/c0402c104k8pactu-kemet-140039; Automotive: No; Mouser Description: Capacitor 100 nF 10 VDC 0402; Category: Cap; Voltage Rating: 10 V; Digikey Description: CAP CER 0.1UF 10V X5R 0402; Ipc Land Pattern Name: CAPC10050X50; Device Class L3: Ceramic Capacitors; Manufacturer Part Number: C0402C104K8PACTU
C22 = CMP-2000-05997-2: CAP CER 4.7UF 10V X5R 0402; Dielectric Material: Ceramic; Tolerance: 10%; Series: C; Package Quantity: 10000; Max Operating Temperature: 85°C; Case Code (Imperial): 0402; Lead Free: Lead Free; Voltage Rating (DC): 10V; Packaging: Cut Tape; Voltage Rating: 10V; Min Operating Temperature: -55°C; Dielectric: X5R; Thickness: 0.022inch; Width: 0.02inch; Case/Package: 0402; Case Code (Metric): 1005; Capacitance: 4.7uF; Length: 0.039inch; RoHS Compliant: Yes; REACH SVHC: No SVHC; Mount: Surface Mount
C24 C26-C28 C30 C32 C34 C36 C38 = CMP-2100-03641-2: CAP CER 0.1UF 16V X7R 0402; Manufacturer: Murata; Standoff Height: 0mm; Tolerance: 10%; Voltage Rating: 16Vdc; Material: Ceramic; Capacitance: 0.10μF; Value: 0.10μF; RoHS: TRUE; Manufacturer Part Number: GRM155R71C104KA88D; Temperature Characteristic: X7R; Octopart: https://octopart.com/grm155r71c104ka88d-murata-196880; Digikey Description: CAP CER 0.1UF 16V X7R 0402; Device Class L3: Ceramic Capacitors; Height: 0.55mm; ComponentLink2Description: Datasheet; Temperature Range Low: -55°C; Ipc Land Pattern Name: CAPC10050X219; ComponentLink2URL: https://search.murata.co.jp/Ceramy/image/img/A01X/G101/ENG/GRM155R71H471KA01-01A.pdf; Device Class L1: Passive Components; Lead Free: yes; Category: Cap; Package: GRM15; Temperature: -55°C to +125°C; Device Class L2: Capacitors; Temperature Range High: +125°C; Mouser Description: 0402 0.1 uF 16V ±10 % Tolerance X7R SMT Multilayer Ceramic Capacitor
C29 C35 C37 = CMP-14477-000104-2: None; Tolerance: 10%; Voltage Rating: 16V; Dielectric: X5R; Capacitance: 1uF; Packaging: Tape and Reel; Depth: 0.5mm; Mount: Surface Mount; Thickness: 0.022inch; Package Quantity: 1; Min Operating Temperature: -55°C; Series: M; Voltage Rating (DC): 16V; Termination: SMD/SMT; Case/Package: 0402; Number of Pins: 2; Case Code (Imperial): 0402; Length: 1mm; Halogen Free: Halogen Free; Case Code (Metric): 1005; Width: 0.02inch; RoHS Compliant: Yes; Radiation Hardening: No; Max Operating Temperature: 85°C; Height: 0.5mm; Construction: Flat
C31 C33 = CMP-08246-004344-1: CAP CER 2.2UF 10V X7S 0402; Dielectric Material: Ceramic; Tolerance: 10%; Mount: Surface Mount; Height: 0.5mm; Package Quantity: 1; Depth: 0.5mm; RoHS Compliant: Yes; Length: 1mm; Thickness: 0.022inch; Packaging: Tape and Reel; Capacitance: 2.2uF; Case Code (Imperial): 0402; Resistor Type: Ceramic; Dielectric: X7S; Case/Package: 0402; Min Operating Temperature: -55°C; Voltage Rating: 10V; Series: C; Weight: 2.3E-05oz; Width: 0.02inch; Voltage Rating (DC): 10V; Case Code (Metric): 1005; Max Operating Temperature: 125°C; Termination: SMD/SMT; Lead Free: Lead Free
C40 = CMP-1036-04819-2: Manufacturer: Kemet; Part Number: C0805C225K9PACTU
C42 C43 = CMP-1036-00709-3: General Purpose Ceramic Capacitor, 0805, 6.8pF, 0.25pF, C0G, 30ppm/°C, 100V; Dissipation Factor: 10%; Insulation Resistance: 100GR; Tolerance: 5%; Max Operating Temperature: 125°C; RoHS Compliant: Yes; Capacitance: 6.8pF; Termination: SMD/SMT; Number of Pins: 2; Packaging: Tape and Reel; Mount: Surface Mount; Case Code (Metric): 2012; Case Code (Imperial): 0805; Height: 0.71mm; Min Operating Temperature: -55°C; Width: 0.049inch; Temperature Coefficient: 0ppm/°C; Length: 2.01mm; Dielectric: C0G; Series: -; Voltage Rating (DC): 100V; Dielectric Material: Ceramic; Depth: 1.25mm; Contact Plating: Tin; Voltage Rating: 100V; Thickness: 0.037inch; Case/Package: 0805; Lead Free: Lead Free; Radiation Hardening: No; Voltage: 100V; Construction: Flat; Package Quantity: 1; REACH SVHC: No SVHC
C46 C47 = CMP-2007-00302-2: CAP CER 18PF 50V C0G/NP0 0805; Manufacturer: KEMET; Temperature Characteristic: C0G; Tolerance: 0.05; Material: Ceramic; Temperature Coefficient: 30ppm/°C; Device Class L2: Capacitors; Capacitance: 18 pF; Temperature: -55°C to +125°C; Value: 18 pF; Package: C0805C-DN; Mouser Description: Cap Ceramic 18pF 50V C0G 5% SMD 0805 125C Paper T/R; Height: 0.88mm; ComponentLink2URL: https://content.kemet.com/datasheets/KEM_C1003_C0G_SMD.pdf; RoHS: TRUE; Octopart: https://octopart.com/c0805c180j5gactu-kemet-144810; ComponentLink2Description: Datasheet; Temperature Range High: +125°C; Digikey Description: CAP CER 18PF 50V C0G/NP0 0805; Device Class L1: Passive Components; Category: Cap; Automotive: No; Device Class L3: Ceramic Capacitors; Voltage Rating: 50 V; Temperature Range Low: -55°C; Ipc Land Pattern Name: CAPC200125X78; Lead Free: Yes; Manufacturer Part Number: C0805C180J5GACTU
D3 D9#1 D10-D12 = CMP-004-00034-2: Led, Red/Grn, 180Mcd/230Mcd, 624Nm/525Nm Rohs Compliant: Yes
D7 = CMP-2000-04993-2: as D1#1 on sheet CANLink; Radiation Hardening: No; Lead Free: Lead Free; Max Reverse Voltage (DC): 100V; Current Rating: 150mA; Forward Current: 150mA; Packaging: Tape and Reel; Number of Pins: 2; Package Quantity: 3000; Max Operating Temperature: 150°C; Min Operating Temperature: -65°C; Average Rectified Current: 150mA; Recovery Time: 4ns; Output Current: 150mA; Peak Non-Repetitive Surge Current: 2A; Width: 1.8mm; Voltage Rating (DC): 100V; Height: 1.2mm; Max Repetitive Reverse Voltage (Vrrm): 100V; Mount: Surface Mount; Length: 2.85mm
D8 = CMP-12225-000055-1: TVS DIODE 26.5V 44V SOT323-3; Manufacturer: STMicroelectronics; Value: 3pF; Direction: Bidirectional; Breakdown Voltage: 28.5V; Automotive Grade: Grade 0; Standoff Height: 0mm; Peak Pulse Power: 170W; Peak Pulse Current: 3A; Number Of Channels: 2; Max Junction Temp: +175°C; Mouser Description: TVS Diodes / ESD Suppressors Automotive dual-line Transil, Transient voltage suppressor (TVS) for CAN bus; Height: 1.1mm; Category: Diode; Reverse Standoff Voltage: 26.5V; Device Class L1: Circuit Protection; Temperature: -55°C to +175°C; RoHS: TRUE; ComponentLink2URL: https://www.st.com/resource/en/datasheet/esdcan02-2bwy.pdf; Device Class L3: unset; Device Class L2: TVS Diodes; Temperature Range High: +175°C; Octopart: https://octopart.com/esdcan02-2bwy-stmicroelectronics-58631133; Ipc Land Pattern Name: SOT65P210X95-3; Temperature Range Low: -55°C; Capacitance: 3pF; Digikey Description: TVS DIODE 26.5V 44V SOT323-3; Automotive: Yes; ComponentLink2Description: Datasheet; Clamping Voltage: 44V; Manufacturer Part Number: ESDCAN02-2BWY; Lead Free: Yes; Package: SOT323-3L
FB1 = CMP-0686-00252-4: Chip Ferrite Bead, 0402, 600Ω @ 100MHz, 0.23Ω, 25%, 900mA; Number of Circuits: 1; Impedance: 600R; DC Resistance (DCR): 230mR; Material: Steel; Length: 1mm; Package Quantity: 10000; Height: 0.5mm; Width: 0.5mm; Max DC Current: 900mA; Number of Lines: 1; Termination: SMD/SMT; Packaging: Tape and Reel; Lead Free: Lead Free; Min Operating Temperature: -55°C; Max Operating Temperature: 125°C; Max Current Rating: 900mA; Case Code (Imperial): 0402; Number of Pins: 2; Current Rating: 900mA; Test Frequency: 100MHz; Case/Package: 0402; Tolerance: 25%; Case Code (Metric): 1005
J3 = CMP-002-00075-1: CONN HEADER SMD 10POS 1.27MM (specifically compatible with J-Link EDU cable) PN: 3220-10-0300-00
L3 = CMP-07251-000006-1: CMC 51UH 200MA 2LN 2KOHM SMD; Element Configuration: Dual; Number of Lines: 2; Core Material: Ferrite; Impedance: 2kR; Test Frequency: 100kHz; Voltage Rating (DC): 50V; Insulation Resistance: 10MR; Material: Steel; Tolerance: 50%; DC Resistance (DCR): 3.5R; RoHS Compliant: Yes; Mount: Surface Mount; REACH SVHC: No SVHC; Termination: SMD/SMT; DC Current: 200mA; Current: 200mA; Lead Free: Lead Free; Contact Plating: Tin; Length: 4.5mm; Max DC Current: 200mA; Width: 0.126inch; Case/Package: 4532; Packaging: Tape and Reel; Package Quantity: 1; Min Operating Temperature: -40°C; Depth: 3.4mm; Series: SRF4532; Max Operating Temperature: 125°C; Current Rating: 200mA; Self Resonant Frequency: 100kHz; Height: 0.118inch; Inductance: 51uH; Resistance: 2kR
LS1 = CMP-00027-00003-1: Audio Indicator 12V 12mA 110dBA 3.5KHz Resonant Frequency Thru-Hole
Q3#1 = CMP-35916-000009-1: MOSFET 2N-CH 60V 0.3A; Input Capacitance: 40pF; Continuous Drain Current (ID): 300mA; Max Power Dissipation: 285mW; FET Type: 2 N-Channel; Rds On Max: 1.5R; Mount: Surface Mount; Drain to Source Voltage (Vdss): 60V; Packaging: Tape and Reel
R4#1 R7 R27 R39#1 = CMP-2000-00180-1: Manufacturer: Panasonic; Part Number: ERJ-3EKF1001V
R6 R8 R23 R25 R30-R32 R35 R36 R37#1 R43#1 R47#1 R48#1 R82 = CMP-1012-00623-3: Chip Resistor, 10 KOhm, +/- 1%, 0.1 W, -55 to 155 degC, 0603 (1608 Metric), RoHS, Tape and Reel; Manufacturer: Panasonic; Voltage Rating: 75V; Case\/Package: 0603; Power Rating: 100mW; Resistance: 10KOhm; Temperature Coefficient: 100ppm\/degreesC; Number of Pins: 2; Package Reference: 603; Depth: 0.8mm; Mount: SurfaceMount; Package Description: 2-Pin Surface Mount Device, Body 1.6 x 0.85 mm; Datasheet Version: 02/2017; Length: 1.6mm; Lead Free: LeadFree; Height: 0.45mm; Number of Terminations: 2; Max Power Dissipation: 100mW; Min Operating Temperature: -55degC; Datasheet URL: https://industrial.panasonic.com/cdbs/www-data/pdf/RDA0000/AOA0000C304.pdf; Termination: SMD/SMT; Case Code (Metric): 1608; Case Code (Imperial): 0603; Tolerance: 1%; Max Operating Temperature: 155degC; RoHSCompliant: true; Voltage Rating (DC): 75V; Radiation Hardening: No; Packaging: TapeandReel; Composition: ThickFilm; Mounting Technology: SurfaceMount; Manufacturer URL: http://www.panasonic.com/; Width: 0.031inch; REACH SVHC: NoSVHC; Contact Plating: Tin; Military Standard: Not; Package Quantity: 1
R21 R22 = CMP-009-00206-2: READ THE NAME
R24 R33 R34 R38#1 R40#1 R41#1 R42#1 R49#1 = CMP-2000-00572-1: Manufacturer: Panasonic; Part Number: ERJ3EKF56R0V
R26 R29 = CMP-1012-00372-3: RES SMD 60.4 OHM 1% 1/10W 0603; Resistance: 60.4R; Voltage Rating (DC): 50V; Voltage Rating: 75V; Temperature Coefficient: 100ppm/°C; Power Rating: 100mW; Mount: Surface Mount; Number of Terminations: 2; Max Operating Temperature: 155°C; Case Code (Metric): 1608; Height: 0.022inch; Case/Package: 0603; Min Operating Temperature: -55°C; REACH SVHC: No SVHC; Series: ERJ; Features: Automotive AEC-Q200; Military Standard: Not; Lead Free: Lead Free; Width: 0.031inch; Case Code (Imperial): 0603; Resistance Tolerance: 1%; Packaging: Tape and Reel; Termination: SMD/SMT; Tolerance: 1%; Contact Plating: Tin; Depth: 0.8mm; Resistor Type: Thick Film; Construction: Rectangular; RoHS Compliant: Yes; Max Power Dissipation: 100mW; Package Quantity: 1; Length: 1.6mm
R28 = CMP-2000-00213-2: Chip Resistor, 120 Ohm, +/- 1%, 0.1 W, -55 to 155 degC, 0603 (1608 Metric), RoHS, Tape and Reel; Manufacturer: Panasonic; Power Rating: 100mW; Voltage Rating (DC): 75V; Resistance: 120Ohm; Temperature Coefficient: 100ppm/degreesC; Number of Terminations: 2; Military Standard: Not; Tolerance: 1%; Min Operating Temperature: -55degC; Packaging: TapeandReel; Lead Free: LeadFree; Max Operating Temperature: 155degC; Manufacturer URL: http://www.panasonic.com/; Case Code (Imperial): 0603; REACH SVHC: NoSVHC; Width: 0.031inch; Datasheet URL: https://industrial.panasonic.com/cdbs/www-data/pdf/RDA0000/AOA0000C283.pdf; RoHSCompliant: true; Max Power Dissipation: 100mW; Termination: SMD/SMT; Package Reference: 0603; Height: 0.022inch; Depth: 0.8mm; Package Description: 2-Pin Surface Mount Device, Body 1.6 x 0.85 mm; Contact Plating: Tin; Length: 1.6mm; Package URL: http://www.st.com/st-web-ui/static/active/en/resource/technical/document/datasheet/CD00001320.pdf; Radiation Hardening: No; Package Quantity: 1; Number of Pins: 2; Datasheet Version: 42095.0; Voltage Rating: 75V; Composition: ThickFilm; Case/Package: 0603; Mount: SurfaceMount; Case Code (Metric): 1608
R44#1 R45#1 R46#1 = CMP-2000-00435-2: Chip Resistor, 330 Ohm, +/- 1%, 0.1 W, -55 to 155 degC, 0603 (1608 Metric), RoHS, Tape and Reel; Gender: Male; Mating Cycles: 10000; Current Rating: 500 mA; Voltage Rating: 10 V; REACH SVHC: No SVHC; PackageDescription: 2-Pin Surface Mount Device, Body 1.6 x 0.85 mm; Contact Finish: Gold; Pins: 8; ComponentLink1Description: Manufacturer URL; Packaging: Tape and Reel; Max Operating Temperature: 85 degC; Contact Material: Copper; Height: 1.45 mm; Width: 1.45 mm; DatasheetVersion: Apr-15; Package Quantity: 1500; Contact Plating: Gold; PackageReference: 0603; Mount: Surface Mount; Lead Pitch: 1.1 mm; Min Operating Temperature: -25 degC; ComponentLink1URL: http://www.panasonic.com/; ComponentLink2URL: http://industrial.panasonic.com/cdbs/www-data/pdf/RDA0000/AOA0000C86.pdf; Length: 13.7 mm; ComponentLink2Description: Datasheet; RoHSCompliant: true
SW1-SW3 = CMP-10040-000029-1: SWITCH TACTILE SPST-NO 0.02A 15V; Operating Force: 240gf; Switch Travel: 0.13mm; Illumination Type: Non-Illuminated; Throw Configuration: SPST; Number of Ports: 1; Current Rating: 5A; Mechanical Life: 500000Cycles; Switch Function: Off-Mom; Connector Type: USB; Actuator Type: Standard; Gender: Receptacle; Number of Contacts: 24; Contact Plating: Gold; Insulation Color: Black; Min Operating Temperature: -40°C; Packaging: Tape and Reel; Flammability Rating: UL94 V-0; Max Operating Temperature: 85°C; Termination: Solder; Mount: Surface Mount
U1 U8 = CMP-2000-06547-1: Quadruple Operational Amplifier, 0.5 V/us, 1.2 MHz, 3 to 32 V, 0 to 70 degC, 14-Pin SOIC (D), Green (RoHS & no Sb/Br), Tube; Manufacturer: Texas Instruments; Unity Gain Bandwidth Product: 1.2MHz; Input Offset Voltage: 7mV; Dual Supply Voltage (Max): ±16V; Single Supply Voltage (Min): 3V; Single Supply Voltage (Max): 32V; Voltage Gain in dB: 100dB; Power Supply Requirement: Single/Dual; Input Bias Current: 250nA; Dual Supply Voltage (Min): ±1.5V; Single Supply Voltage (Typ): 5/9/12/15/18/24/28V; Dual Supply Voltage (Typ): ±3/±5/±9/±12/±15V; Number of  Elements: 4; Common Mode Rejection Ratio: 65dB; Datasheet Version: Rev. W, 03/2015; Technology: Bipolar; Shut Down Feature: No; Package Reference: D0014A; Type: GeneralPurposeAmplifier; Pin Count: 14; Package Type: SOIC; Rail/Rail I/O Type: No; Manufacturer URL: http://www.ti.com/; Package Description: 14-Pin Small Outline Integrated Circuit, Body 8.65 x 3.9 mm, Pitch 1.27 mm; Operating Temperature Classification: Commercial; Datasheet URL: http://www.ti.com/lit/ds/symlink/lm324.pdf; Slew Rate: 0.5V/us; Package URL: http://www.ti.com/lit/ml/mpds177g/mpds177g.pdf; Mounting: SurfaceMount; Packaging: Rail/Tube; Mounting Technology: SurfaceMount; Operating Temp Range: 0Cto70C
U4 = CMP-12105-000107-1: IC MCU 32BIT 128KB FLASH 100LQFP
U5 = CMP-0054-00372-2: 8-Channel, 50 kSPS to 200 kSPS, 8-Bit A/D Converter, 16-pin TSSOP, Pb-Free; Manufacturer: National Semiconductor; PackageTopMarking: NSUZXYTT*88S022*CIMT; CompType: ADC IC; PowerWise: Y; ComponentLink2URL: http://www.national.com/pf/AD/ADC088S022.html; RoHS: Y; PackageDescription: Molded TSSOP, Jedec, 5 x 4.4 x 0.9mm Body, 16 Lead, 0.65mm Pitch; DatasheetVersion: Feb-2010; PinCount: 16; ComponentLink1Description: ADC088S022 Datasheet; Code_JEDEC: MO-153-AB; ComponentLink3URL: http://www.national.com/packaging/folders/mtc16.html; PackageVersion: revD, Jun-2003; ComponentLink3Description: MTC16 Package Page; RevisionNote: Component URLs added; ComponentLink1URL: http://www.national.com/ds/AD/ADC088S022.pdf; ComponentLink2Description: ADC088S022 Web Page; PackageReference: MTC16
U6 = CMP-015-00012-2: Automotive CAN FD transceiver with watchdog, bus diagnostics and partial networking via sele 14-SOT-23-THIN -40 to 150
U7 = CMP-12756-000009-1: IC REG LINEAR 5V 150MA SOT89; Manufacturer: Diodes Inc.; Output Type: Fixed; Min Supply Voltage: 3.3V; Max Junction Temp: +125°C; Max Supply Voltage: 40V; Nominal Supply Current: 2.5-25uA; Number Of Outputs: 1; Dropout Voltage: 1000mV; Manufacturer Part Number: AP7381-50Y-13; RoHS: TRUE; Digikey Description: IC REG LINEAR 5V 150MA SOT89; Output Voltage: 5V; Footprint Url: https://www.diodes.com/assets/Package-Files/SOT89.pdf; Category: IC; Temperature: -40°C to +125°C; ComponentLink2Description: Datasheet; Package: SOT89; Temperature Range Low: -40°C; Temperature Range High: +125°C; ComponentLink2URL: https://www.diodes.com/assets/Datasheets/AP7381.pdf; Device Class L1: Integrated Circuits (ICs); Automotive: No; Output Current: 150mA; Ambient Temperature Range High: +85°C; Octopart: https://octopart.com/ap7381-50y-13-diodes+inc.-87775116; Lead Free: Yes; Device Class L2: Power Management ICs; Height: 1.6mm; Device Class L3: Voltage Regulators - Linear; Ambient Temperature Range Low: -40°C
Y1 = CMP-27762-011708-1: Crystal 48MHz ±20ppm 18pF SMD-4 3.2mm x 2.5mm; Series Resistance: 35R; Frequency Stability: 50ppm; Package Quantity: 1000; Packaging: Tape and Reel; Mount: Surface Mount; Length: 3.2mm; Load Capacitance: 18pF; Max Operating Temperature: 70°C; Operating Frequency: 48 MHz; RoHS Compliant: Yes; Series: ABM8; Frequency Tolerance: 20ppm; Lead Free: Lead Free; Min Operating Temperature: -20°C; Case/Package: CSMD; Number of Pins: 4; Height: 0.031inch; ESR (Equivalent Series Resistance): 35R; Frequency: 48MHz; Radiation Hardening: No; Width: 0.098inch; Tolerance: 20ppm; Termination: SMD/SMT; Depth: 2.5mm; Resistor Type: Ceramic; REACH SVHC: No SVHC
Y2 = CMP-40224-000006-1: CRYSTAL 32.7680KHZ 12.5PF SMD; Manufacturer: ECS International; Frequency: 32.768kHz; Esr: 90kΩ; Tolerance: 20ppm; Device Class L1: Passive Components; Load Capacitance: 12.5pF; Temperature: -40°C to +85°C; ComponentLink2URL: https://ecsxtal.com/store/pdf/ECX-1210.pdf; Series: ECX-1210; Octopart: https://octopart.com/ecs-.327-12.5-1210-tr-ecs+international-81221340; ComponentLink2Description: Datasheet; Temperature Range Low: -40°C; Digikey Description: CRYSTAL 32.7680KHZ 12.5PF SMD; Lead Free: Yes; RoHS: TRUE; Device Class L3: Crystals; Automotive: No; Category: Crys; Height: 0.5mm; Manufacturer Part Number: ECS-.327-12.5-1210-TR; Temperature Range High: +85°C; Device Class L2: Crystals / Oscillators; Package: ECX-1210

## Sheet SD.SchDoc
size A4; SheetNumber: 2; SheetTotal: 6
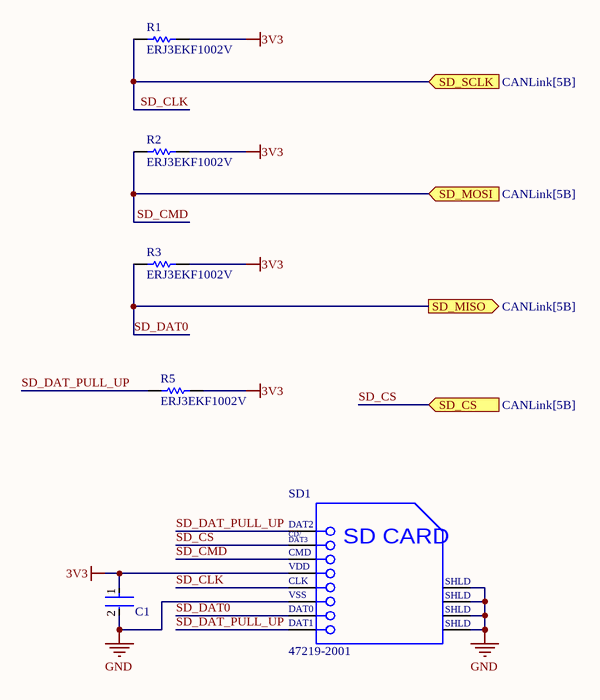
[diagram p5: SD.SchDoc]

### Parts
C1  C0402C104K8PACTU  [FP-C0402-BB-MFG]  (value not drawn)
R1  ERJ3EKF1002V  [RESC1609X55X30LL15T15]
R2  ERJ3EKF1002V  [RESC1609X55X30LL15T15]
R3  ERJ3EKF1002V  [RESC1609X55X30LL15T15]
R5  ERJ3EKF1002V  [RESC1609X55X30LL15T15]
SD1  47219-2001  [MOLX-47219-2001-8_V]

### Ports
SD_CS (in, see CANLink[5B]), SD_MISO (out, see CANLink[5B]), SD_MOSI (in, see CANLink[5B]), SD_SCLK (in, see CANLink[5B])

### Nets
3V3: C1.1 R1.2 R2.2 R3.2 R5.2 SD1.4(VDD)  [project net INT_3V3]
GND: C1.2 SD1.6(VSS) SD1.9(SHLD) SD1.10(SHLD) SD1.11(SHLD) SD1.12(SHLD)
SD_CLK: R1.1 SD1.5(CLK) ; port SD_SCLK
SD_CMD: R2.1 SD1.3(CMD) ; port SD_MOSI
SD_CS: SD1.2(CD/DAT3) ; port SD_CS
SD_DAT0: R3.1 SD1.7(DAT0) ; port SD_MISO
SD_DAT_PULL_UP: R5.1 SD1.1(DAT2) SD1.8(DAT1)

### Notes on the sheet
- (in symbol CMP-2000-05245-1) CD/; DAT3; SD CARD

### Library data of the parts
C1 = CMP-2008-02046-2: as C14 on sheet STM32H730_PINOUT; Package: C0402-BB; Temperature: -55°C to +125°C; ComponentLink2Description: Datasheet; Temperature Characteristic: X5R; Device Class L1: Passive Components; Height: 0.55mm; Lead Free: Yes; ComponentLink2URL: https://content.kemet.com/datasheets/KEM_C1002_X7R_SMD.pdf; Device Class L2: Capacitors; Temperature Range Low: -55°C; Temperature Range High: +125°C; RoHS: TRUE; Octopart: https://octopart.com/c0402c104k8pactu-kemet-140039; Automotive: No; Mouser Description: Capacitor 100 nF 10 VDC 0402; Category: Cap; Voltage Rating: 10 V; Digikey Description: CAP CER 0.1UF 10V X5R 0402; Ipc Land Pattern Name: CAPC10050X50; Device Class L3: Ceramic Capacitors; Manufacturer Part Number: C0402C104K8PACTU
R1-R3 R5 = CMP-1012-00623-3: as R6 on sheet STM32H730_PINOUT; Number of Pins: 2; Package Reference: 603; Depth: 0.8mm; Mount: SurfaceMount; Package Description: 2-Pin Surface Mount Device, Body 1.6 x 0.85 mm; Datasheet Version: 02/2017; Length: 1.6mm; Lead Free: LeadFree; Height: 0.45mm; Number of Terminations: 2; Max Power Dissipation: 100mW; Min Operating Temperature: -55degC; Datasheet URL: https://industrial.panasonic.com/cdbs/www-data/pdf/RDA0000/AOA0000C304.pdf; Termination: SMD/SMT; Case Code (Metric): 1608; Case Code (Imperial): 0603; Tolerance: 1%; Max Operating Temperature: 155degC; RoHSCompliant: true; Voltage Rating (DC): 75V; Radiation Hardening: No; Packaging: TapeandReel; Composition: ThickFilm; Mounting Technology: SurfaceMount; Manufacturer URL: http://www.panasonic.com/; Width: 0.031inch; REACH SVHC: NoSVHC; Contact Plating: Tin; Military Standard: Not; Package Quantity: 1
SD1 = CMP-2000-05245-1: MicroSD Card Connector, Hinge Type, -40 to 85 degC, 8-Pin SMD, RoHS, Tape and Reel; Manufacturer: Molex; Current Rating: 500mA; Number of Contacts: 8; Pitch: 1.09mm; Insertion - Extraction Style: Hinged; Voltage Rating: 100VDC; Product: CardConnectors; Contact Material: CopperAlloy; Series: 47219; Packaging: Reel; Brand: Molex; Product Category: MemoryCardConnectors; Housing Material: Thermoplastic; Mounting Style: SMD/SMT; Termination Style: SMD; Datasheet Version: Rev. F, 06/2009; Card Type: microSD; Manufacturer URL: http://www.molex.com/; RoHS: Details; Datasheet URL: http://www.molex.com/pdm_docs/sd/472192001_sd.pdf; Factory Pack Quantity: 2400

## Sheet CAN_IF.SchDoc
size A4; SheetNumber: 3; SheetTotal: 5
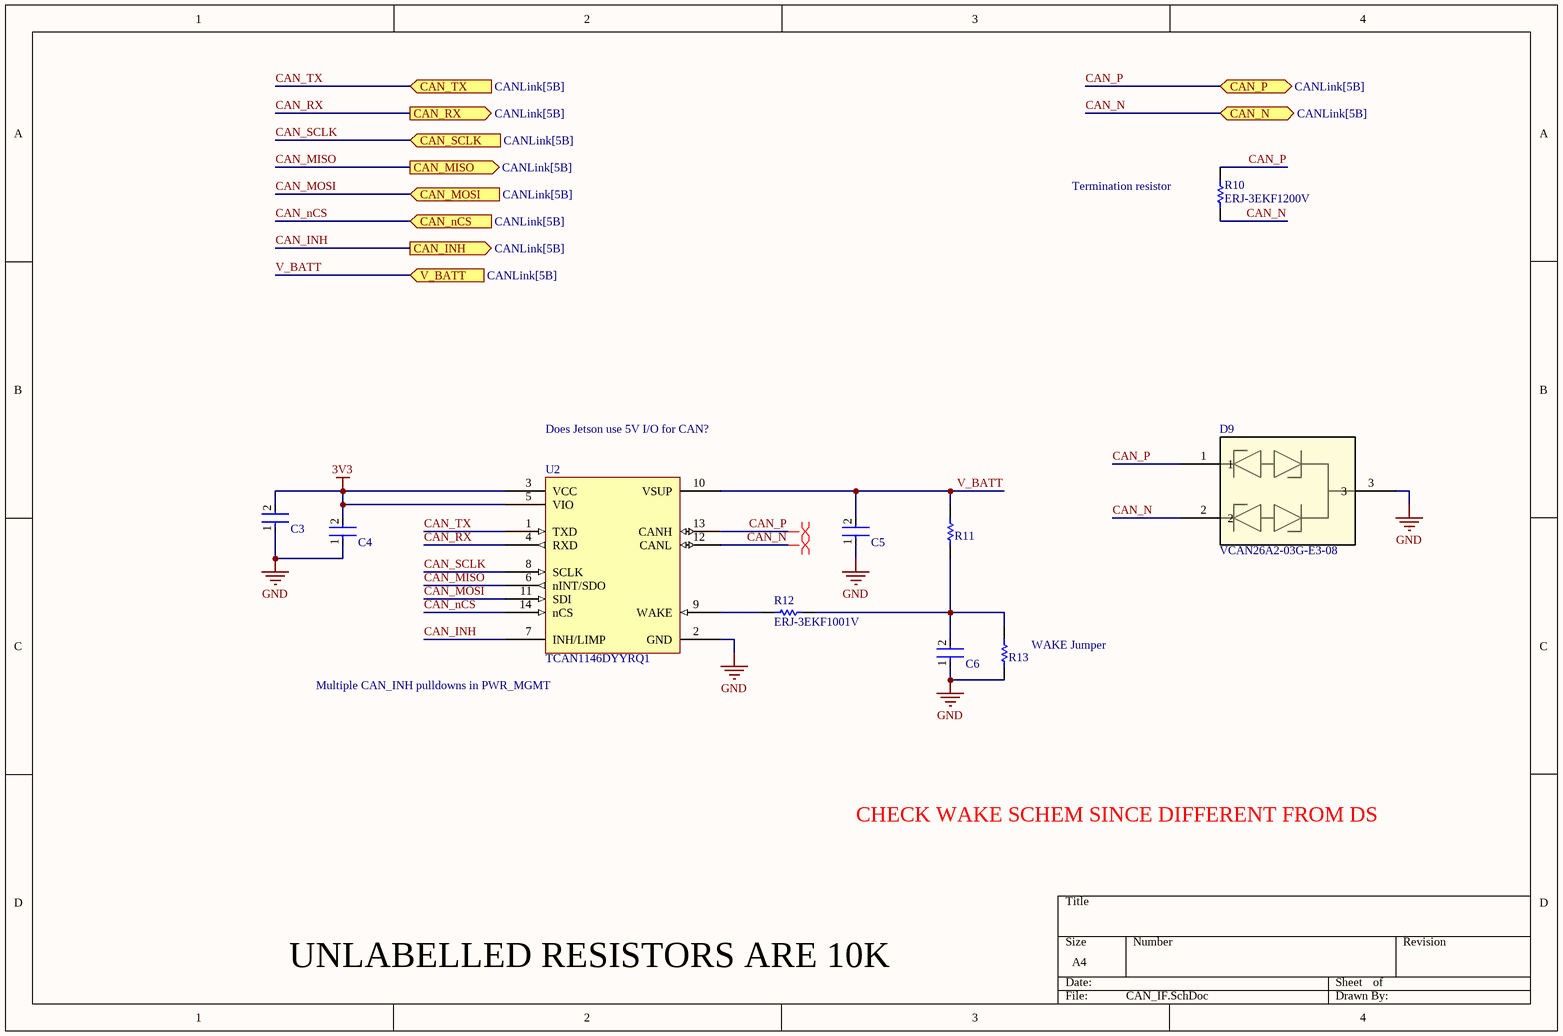
[diagram p6: CAN_IF.SchDoc]

### Parts
(Parts that share a designator on the sheet are numbered #1, #2 ... from top to bottom, then left to right.)
C3  C0402C104K8PACTU  [FP-C0402-BB-MFG]  (value not drawn)
C4  C0402C104K8PACTU  [FP-C0402-BB-MFG]  (value not drawn)
C5  C0402C104K8PACTU  [FP-C0402-BB-MFG]  (value not drawn)
C6  C0402C104K8PACTU  [FP-C0402-BB-MFG]  (value not drawn)
D9#2  VCAN26A2-03G-E3-08  [VCAN26A2-03G-E3-08-Footprint-1]
R10  ERJ-3EKF1200V  [RESC1609X55X30ML15T15]
R11  ERJ3EKF1002V  [RESC1609X55X30LL15T15]  (value not drawn)
R12  ERJ-3EKF1001V  [RESC1608X55X30LL15T15]
R13  0402 JUMPER 0 OHM  [RESC1005X40X25NL05T05]  (value not drawn)
U2  TCAN1146DYYRQ1  [TCAN1146DYYRQ1-Footprint-1]

### Ports
CAN_INH (out, see CANLink[5B]), CAN_MISO (out, see CANLink[5B]), CAN_MOSI (in, see CANLink[5B]), CAN_N (bidir, see CANLink[5B]), CAN_nCS (in, see CANLink[5B]), CAN_P (bidir, see CANLink[5B]), CAN_RX (out, see CANLink[5B]), CAN_SCLK (in, see CANLink[5B]), CAN_TX (in, see CANLink[5B]), V_BATT (in, see CANLink[5B])

### Nets
3V3: C3.2 C4.2 U2.3(VCC) U2.5(VIO)  [project net INT_3V3]
GND: C3.1 C4.1 C5.1 C6.1 D9#2.3 R13.1 U2.2(GND)
CAN_INH: U2.7(INH/LIMP) ; port CAN_INH
CAN_MISO: U2.6(nINT/SDO) ; port CAN_MISO
CAN_MOSI: U2.11(SDI) ; port CAN_MOSI
CAN_N: D9#2.2 R10.1 U2.12(CANL) ; port CAN_N  [project net CAN1_N]
CAN_nCS: U2.14(nCS) ; port CAN_nCS
CAN_P: D9#2.1 R10.2 U2.13(CANH) ; port CAN_P  [project net CAN1_P]
CAN_RX: U2.4(RXD) ; port CAN_RX  [project net CAN1_RX]
CAN_SCLK: U2.8(SCLK) ; port CAN_SCLK
CAN_TX: U2.1(TXD) ; port CAN_TX  [project net CAN1_TX]
V_BATT: C5.2 R11.1 U2.10(VSUP) ; port V_BATT  [project net CAN_PWR]
NetC6_2: C6.2 R11.2 R12.2 R13.2
NetR12_1: R12.1 U2.9(WAKE)

### Layout directives
differential pair: CAN1_N, CAN1_P

### Notes on the sheet
- (near R10) Termination resistor
- Does Jetson use 5V I/O for CAN?
- (near R13) WAKE Jumper
- (near U2) Multiple CAN_INH pulldowns in PWR_MGMT
- CHECK WAKE SCHEM SINCE DIFFERENT FROM DS
- UNLABELLED RESISTORS ARE 10K

### Library data of the parts
C3-C6 = CMP-2008-02046-2: as C14 on sheet STM32H730_PINOUT; Package: C0402-BB; Temperature: -55°C to +125°C; ComponentLink2Description: Datasheet; Temperature Characteristic: X5R; Device Class L1: Passive Components; Height: 0.55mm; Lead Free: Yes; ComponentLink2URL: https://content.kemet.com/datasheets/KEM_C1002_X7R_SMD.pdf; Device Class L2: Capacitors; Temperature Range Low: -55°C; Temperature Range High: +125°C; RoHS: TRUE; Octopart: https://octopart.com/c0402c104k8pactu-kemet-140039; Automotive: No; Mouser Description: Capacitor 100 nF 10 VDC 0402; Category: Cap; Voltage Rating: 10 V; Digikey Description: CAP CER 0.1UF 10V X5R 0402; Ipc Land Pattern Name: CAPC10050X50; Device Class L3: Ceramic Capacitors; Manufacturer Part Number: C0402C104K8PACTU
D9#2 = CMP-004-00042-1: ESD Suppressor Diode TVS Bi-Dir 26.5V 3-Pin SOT-323 T/R
R10 = CMP-2000-00213-2: as R28 on sheet STM32H730_PINOUT; Number of Terminations: 2; Military Standard: Not; Tolerance: 1%; Min Operating Temperature: -55degC; Packaging: TapeandReel; Lead Free: LeadFree; Max Operating Temperature: 155degC; Manufacturer URL: http://www.panasonic.com/; Case Code (Imperial): 0603; REACH SVHC: NoSVHC; Width: 0.031inch; Datasheet URL: https://industrial.panasonic.com/cdbs/www-data/pdf/RDA0000/AOA0000C283.pdf; RoHSCompliant: true; Max Power Dissipation: 100mW; Termination: SMD/SMT; Package Reference: 0603; Height: 0.022inch; Depth: 0.8mm; Package Description: 2-Pin Surface Mount Device, Body 1.6 x 0.85 mm; Contact Plating: Tin; Length: 1.6mm; Package URL: http://www.st.com/st-web-ui/static/active/en/resource/technical/document/datasheet/CD00001320.pdf; Radiation Hardening: No; Package Quantity: 1; Number of Pins: 2; Datasheet Version: 42095.0; Voltage Rating: 75V; Composition: ThickFilm; Case/Package: 0603; Mount: SurfaceMount; Case Code (Metric): 1608
R11 = CMP-1012-00623-3: as R6 on sheet STM32H730_PINOUT; Number of Pins: 2; Package Reference: 603; Depth: 0.8mm; Mount: SurfaceMount; Package Description: 2-Pin Surface Mount Device, Body 1.6 x 0.85 mm; Datasheet Version: 02/2017; Length: 1.6mm; Lead Free: LeadFree; Height: 0.45mm; Number of Terminations: 2; Max Power Dissipation: 100mW; Min Operating Temperature: -55degC; Datasheet URL: https://industrial.panasonic.com/cdbs/www-data/pdf/RDA0000/AOA0000C304.pdf; Termination: SMD/SMT; Case Code (Metric): 1608; Case Code (Imperial): 0603; Tolerance: 1%; Max Operating Temperature: 155degC; RoHSCompliant: true; Voltage Rating (DC): 75V; Radiation Hardening: No; Packaging: TapeandReel; Composition: ThickFilm; Mounting Technology: SurfaceMount; Manufacturer URL: http://www.panasonic.com/; Width: 0.031inch; REACH SVHC: NoSVHC; Contact Plating: Tin; Military Standard: Not; Package Quantity: 1
R12 = CMP-2000-00180-1: Manufacturer: Panasonic; Part Number: ERJ-3EKF1001V
R13 = CMP-009-00206-2: READ THE NAME
U2 = CMP-015-00012-2: as U6 on sheet STM32H730_PINOUT